# EasyEDA Pro project controller.eprj

# Schematic 主控

## Sheets
1 mcu: Board Name: 控制器; Create Date: 2025-05-31; Page Name: mcu; Project Name: controller; Schematic Name: 主控; Update Date: 2025-06-05; Company: 嘉立创EDA; Page Size: A4; Version: V1.0
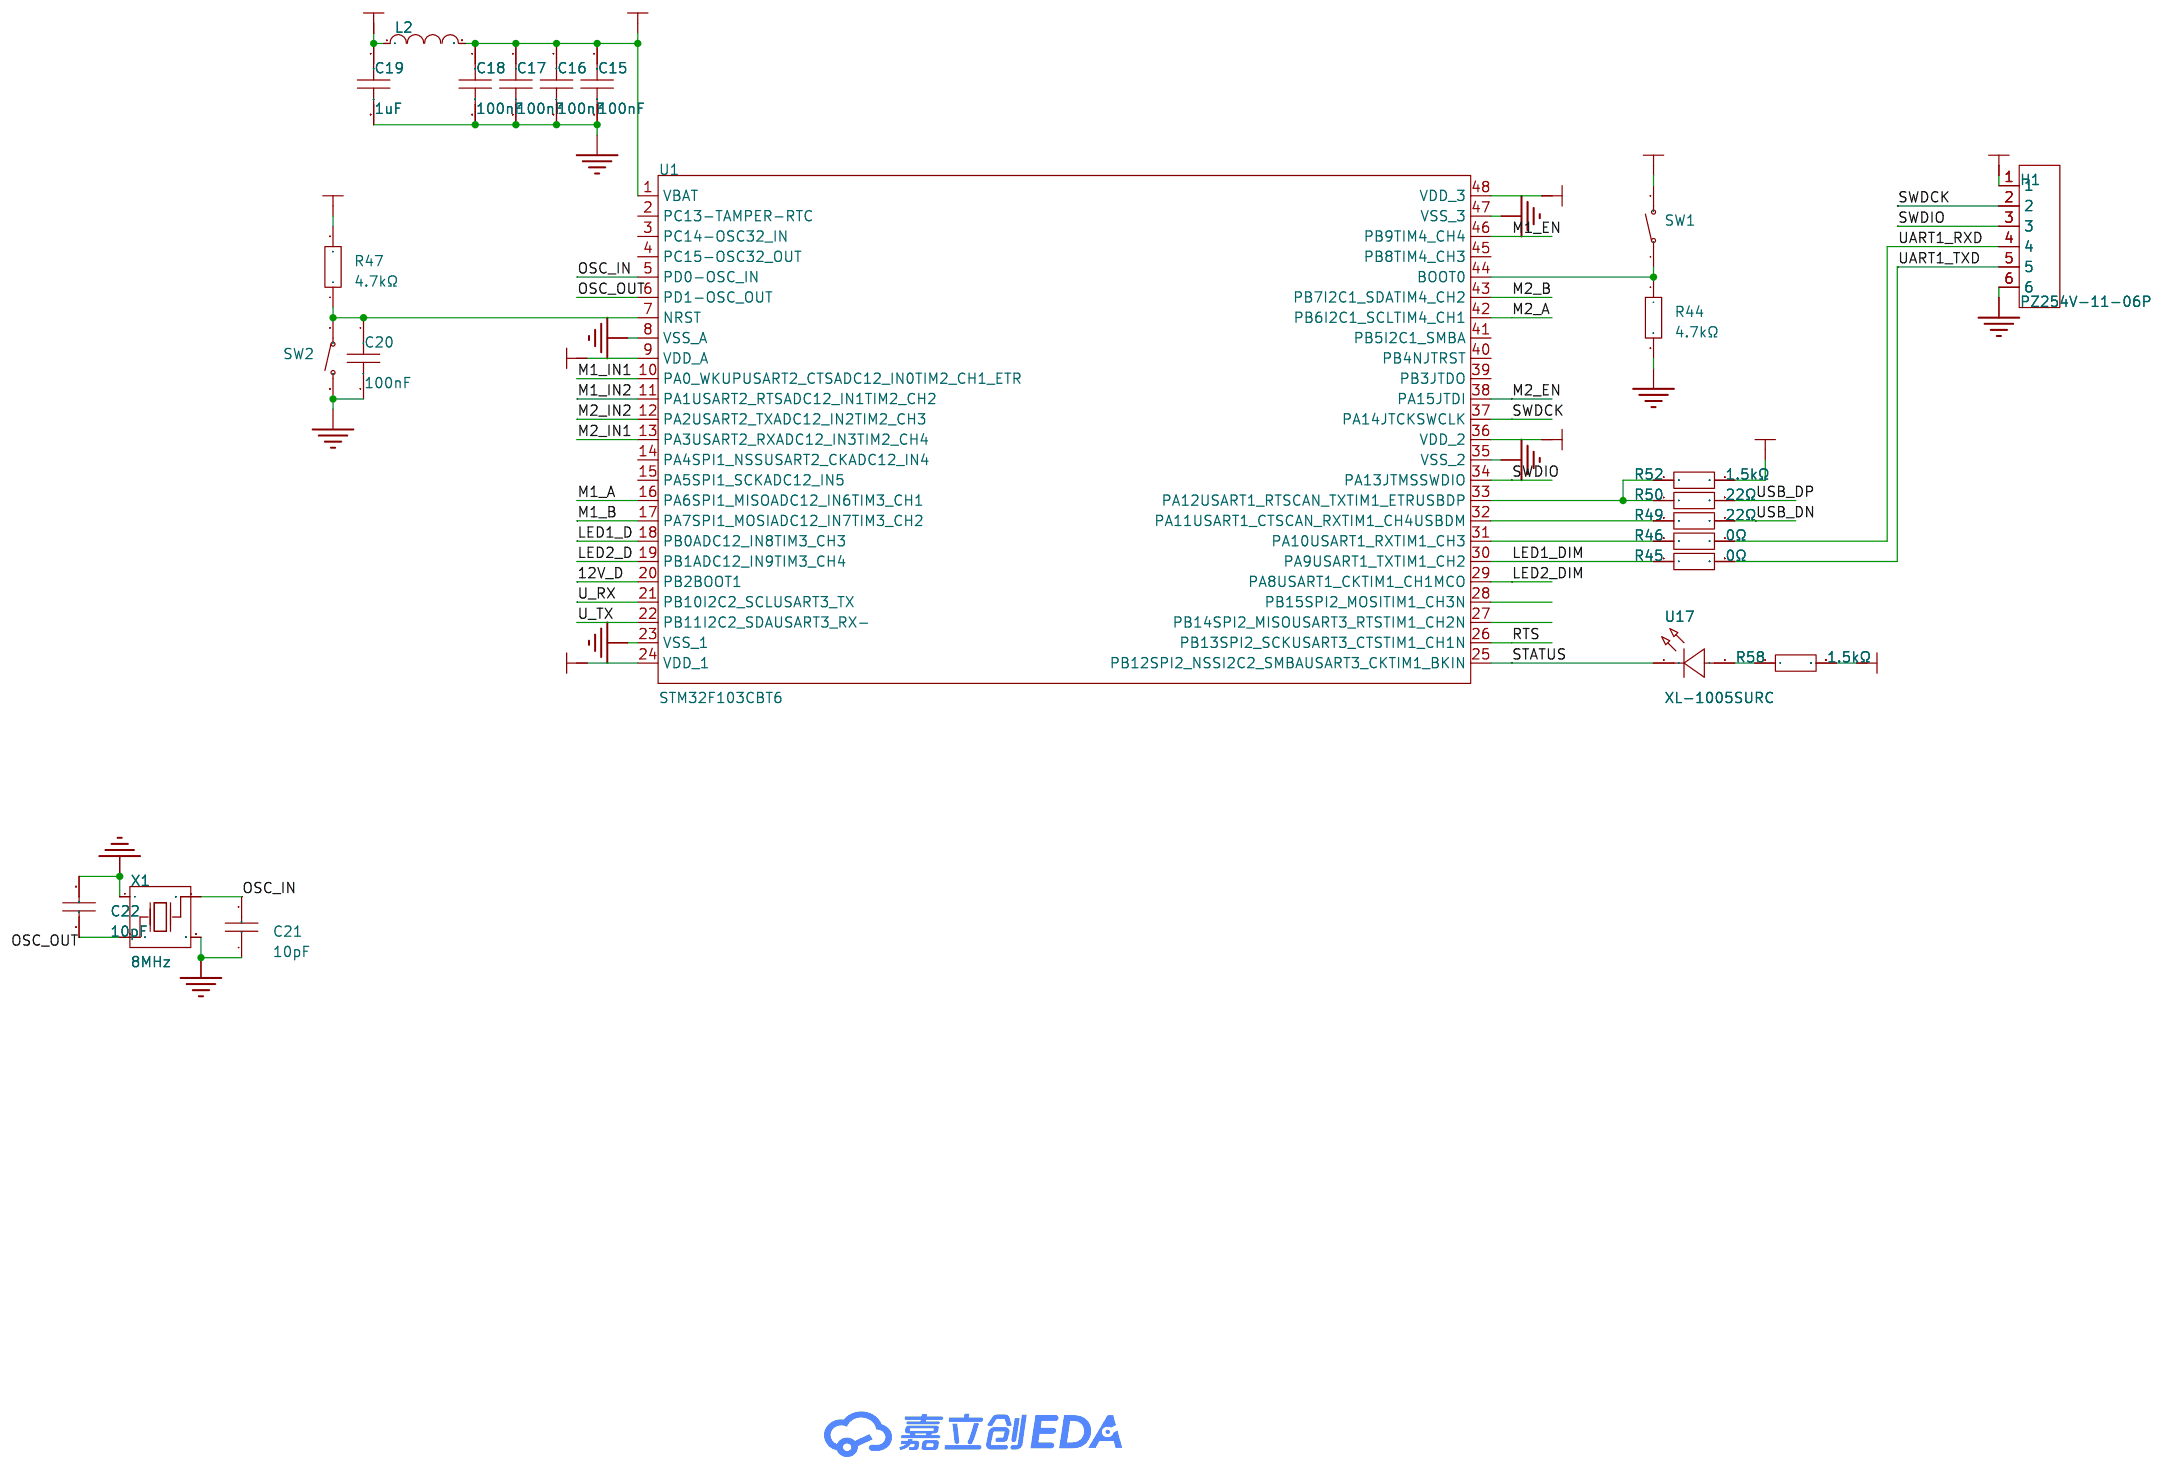
[diagram p0: mcu]
2 power: Page Name: power
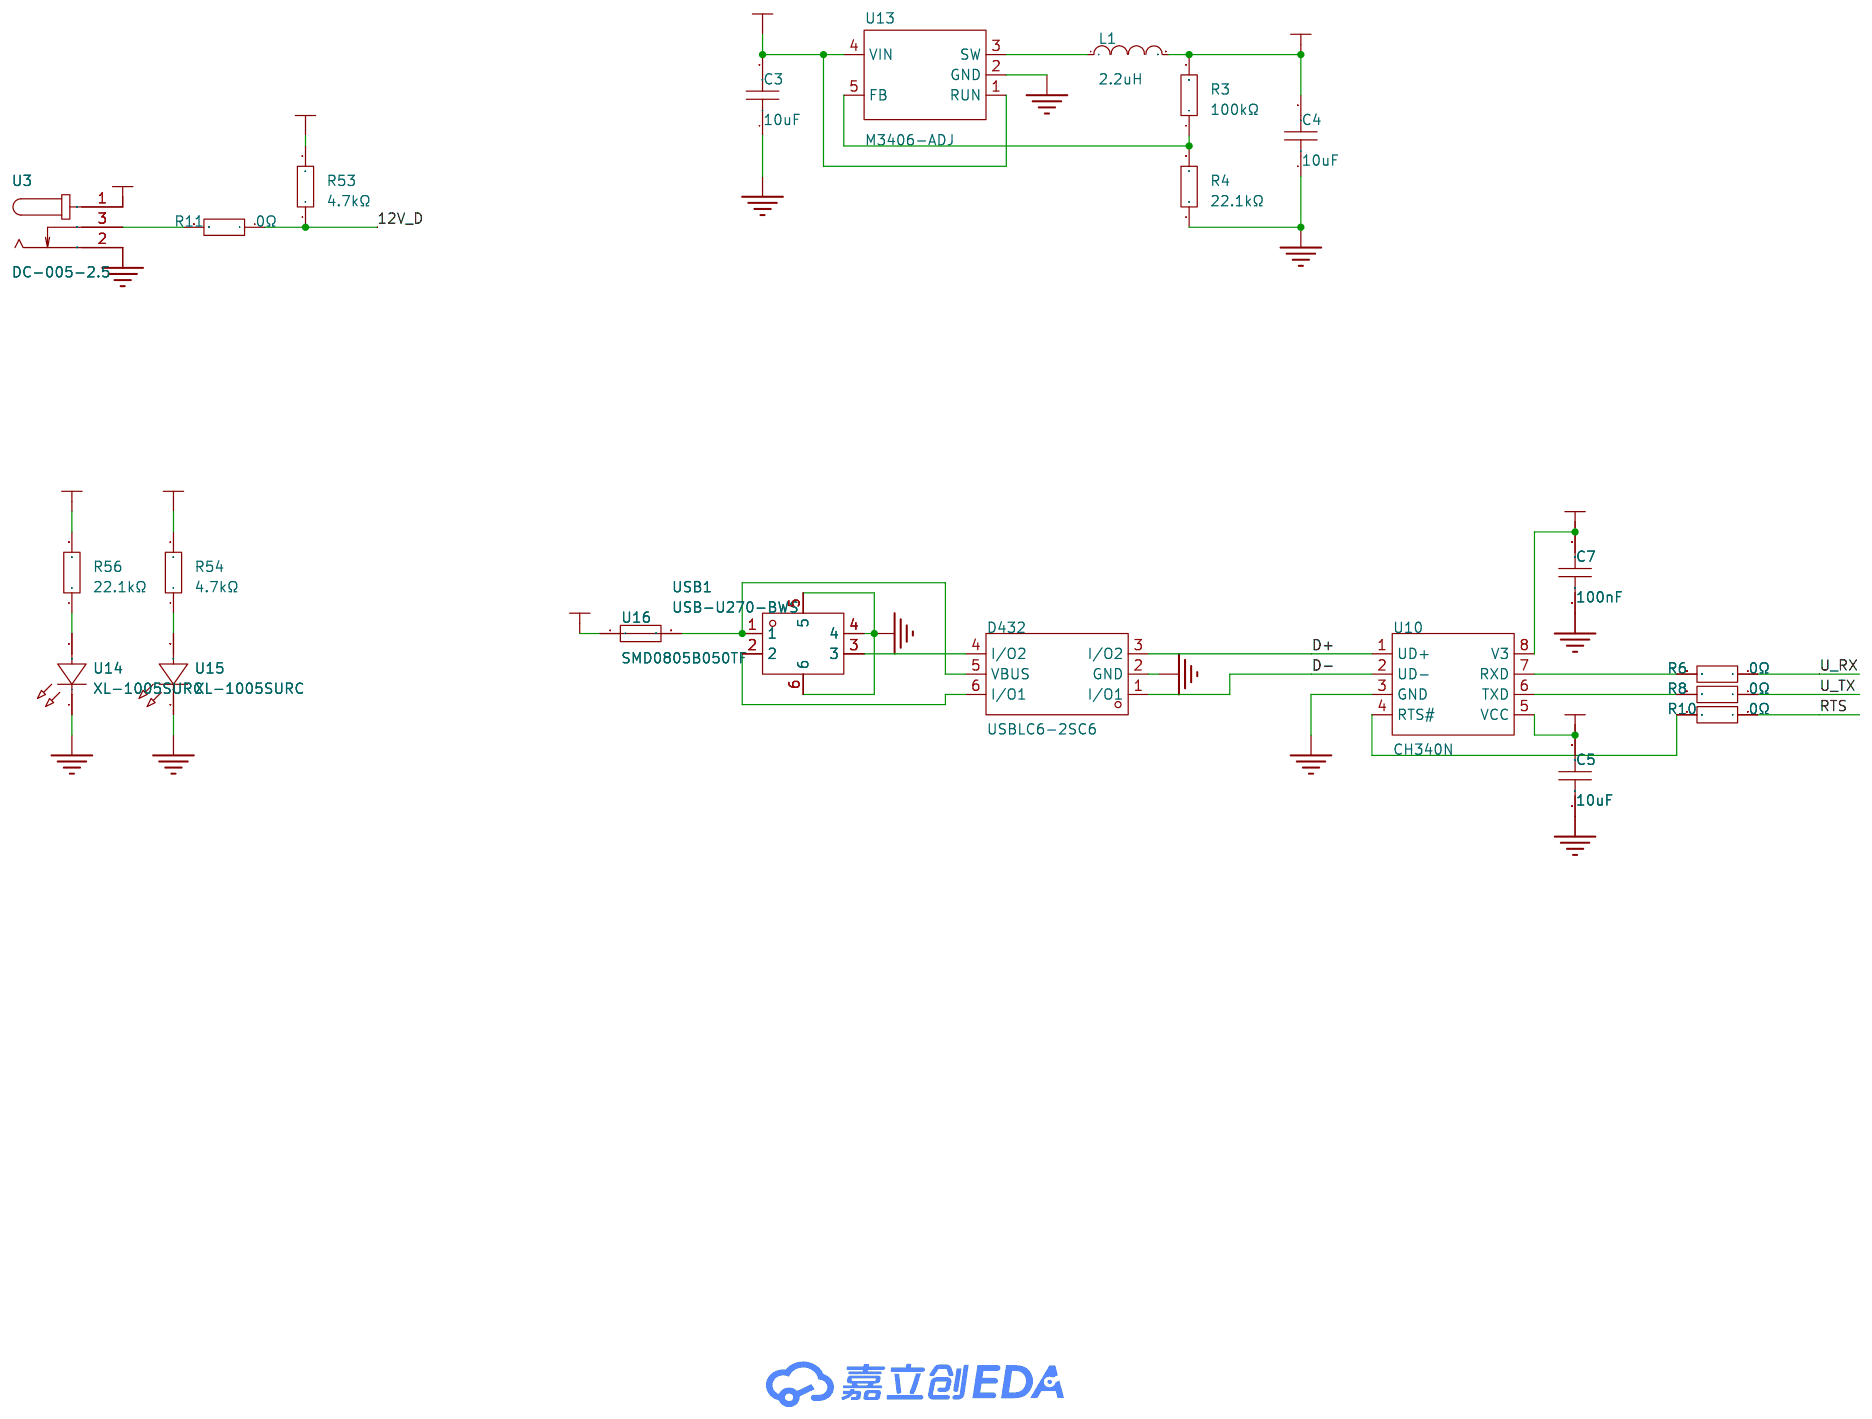
[diagram p1: power]
3 led: Page Name: led
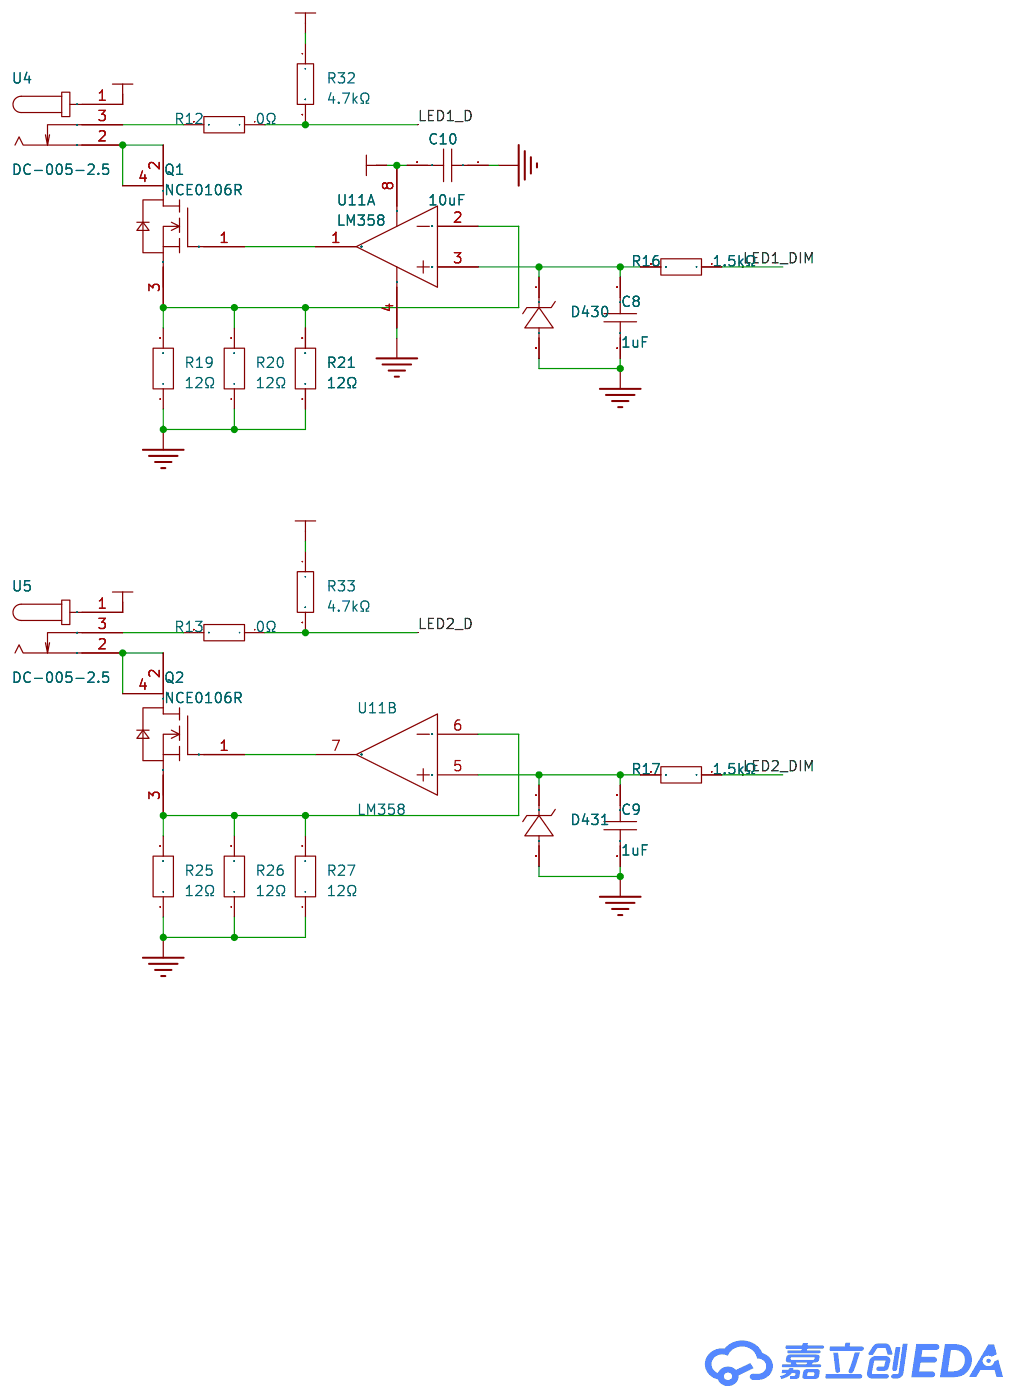
[diagram p2: led]
4 motor: Page Name: motor; Update Date: 2025-06-04
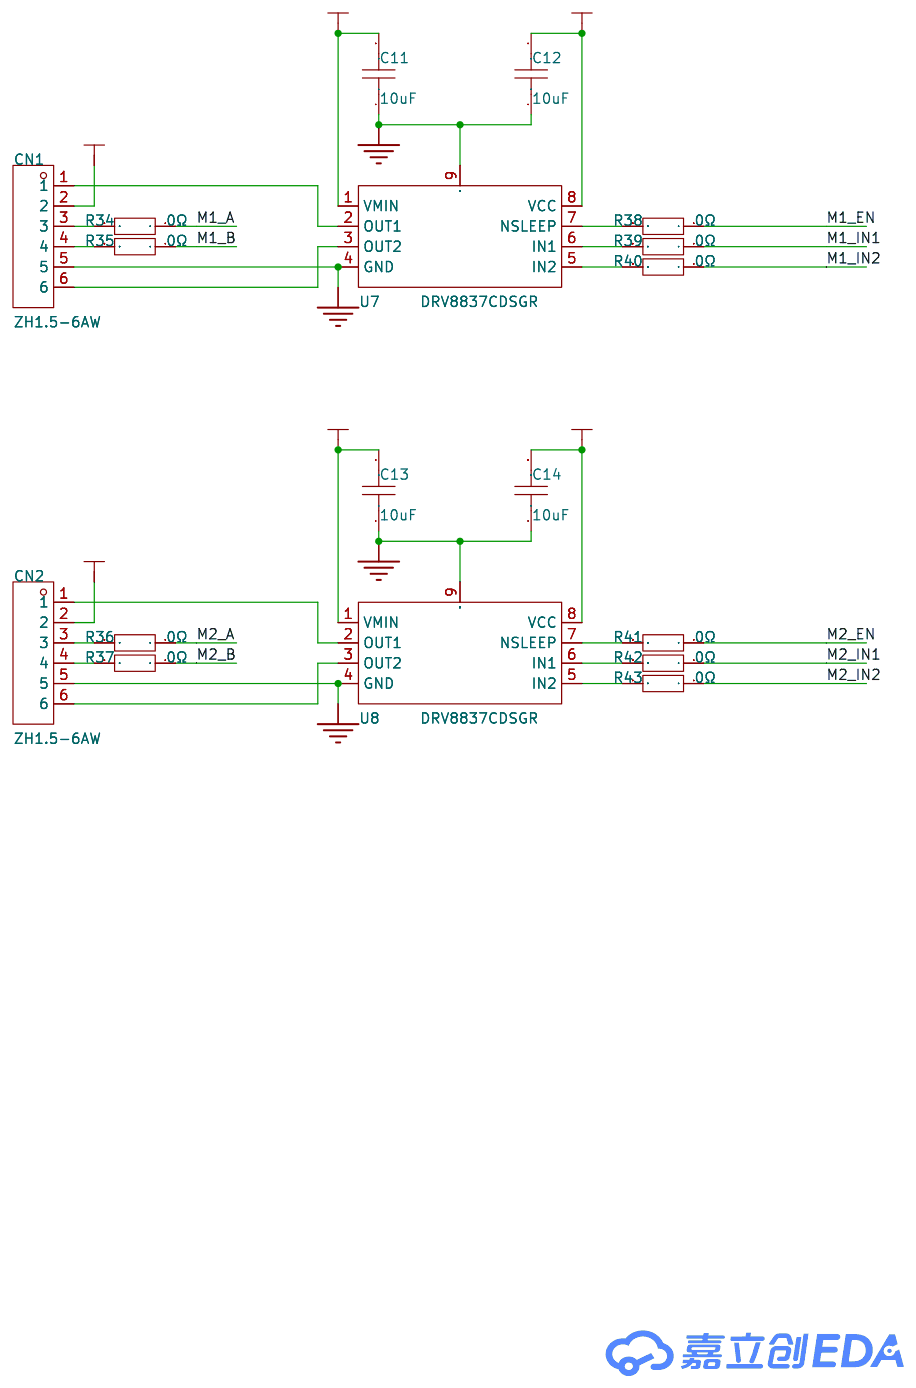
[diagram p3: motor]
5 typec: Create Date: 2025-06-05; Page Name: typec
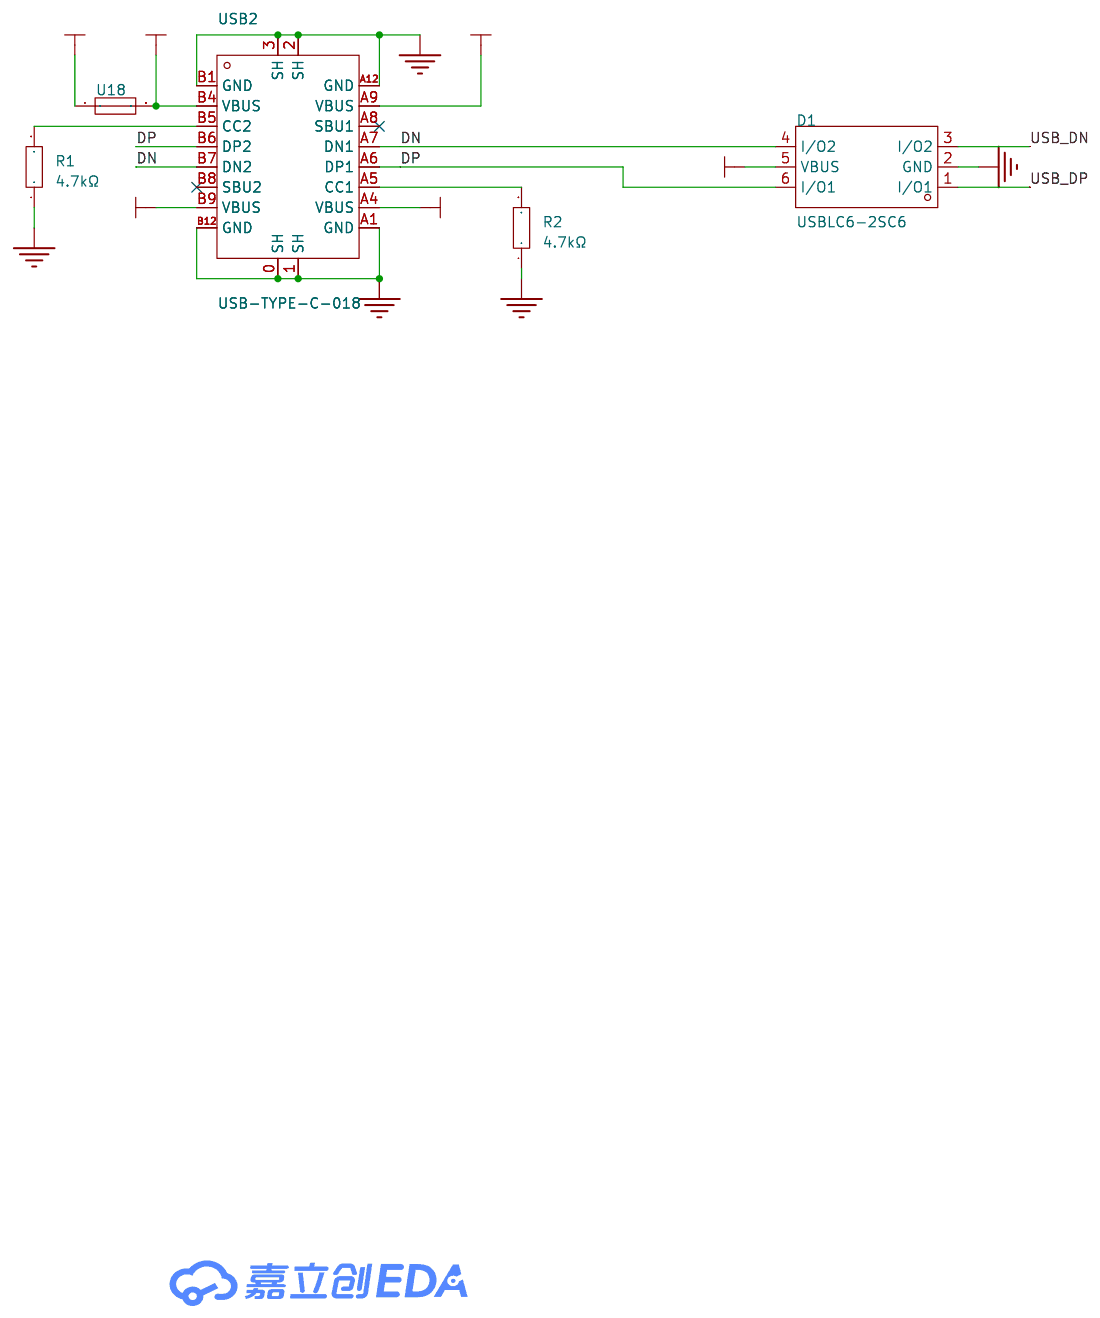
[diagram p4: typec]

## Parts
sheet led
C8  1uF  [C0402]
C9  1uF  [C0402]
C10  10uF  [C0603]
D430  ZMM3V3  [LL-34_L3.5-W1.5-RD]
D431  ZMM3V3  [LL-34_L3.5-W1.5-RD]
Q1  NCE0106R  [SOT-223_L6.5-W3.5-P2.30-LS7.0-BR]
Q2  NCE0106R  [SOT-223_L6.5-W3.5-P2.30-LS7.0-BR]
R12  0Ω  [R0402]
R13  0Ω  [R0402]
R16  1.5kΩ  [R0402]
R17  1.5kΩ  [R0402]
R19  12Ω  [R2512]
R20  12Ω  [R2512]
R21  12Ω  [R2512]
R25  12Ω  [R2512]
R26  12Ω  [R2512]
R27  12Ω  [R2512]
R32  4.7kΩ  [R0402]
R33  4.7kΩ  [R0402]
U4  DC-005-2.5  [DC-IN-TH_DC-005-2.5_C9900097950]
U5  DC-005-2.5  [DC-IN-TH_DC-005-2.5_C9900097950]
U11  LM358  [SOIC-8_L4.9-W3.9-P1.27-LS6.0-BL]  (sections 1,2)
sheet mcu
C15  100nF  [C0402]
C16  100nF  [C0402]
C17  100nF  [C0402]
C18  100nF  [C0402]
C19  1uF  [C0402]
C20  100nF  [C0402]
C21  10pF  [C0402]
C22  10pF  [C0402]
H1  PZ254V-11-06P  [HDR-TH_6P-P2.54-V-M]
L2  GZ1005D102CTF  [L0402]
R44  4.7kΩ  [R0402]
R45  0Ω  [R0402]
R46  0Ω  [R0402]
R47  4.7kΩ  [R0402]
R49  22Ω  [R0402]
R50  22Ω  [R0402]
R52  1.5kΩ  [R0402]
R58  1.5kΩ  [R0402]
SW1  TS342A2P 160gf 021  [KEY-SMD_L3.9-W3.0-LS5.0]
SW2  TS342A2P 160gf 021  [KEY-SMD_L3.9-W3.0-LS5.0]
U1  STM32F103CBT6  [LQFP-48_L7.0-W7.0-P0.50-LS9.0-BL]
U17  XL-1005SURC  [LED0402-RD]
X1  8MHz  [CRYSTAL-SMD_4P-L3.2-W2.5-BL]
sheet motor
C11  10uF  [C0603]
C12  10uF  [C0603]
C13  10uF  [C0603]
C14  10uF  [C0603]
CN1  ZH1.5-6AW  [CONN-TH_ZH1.5-6AW]
CN2  ZH1.5-6AW  [CONN-TH_ZH1.5-6AW]
R34  0Ω  [R0402]
R35  0Ω  [R0402]
R36  0Ω  [R0402]
R37  0Ω  [R0402]
R38  0Ω  [R0402]
R39  0Ω  [R0402]
R40  0Ω  [R0402]
R41  0Ω  [R0402]
R42  0Ω  [R0402]
R43  0Ω  [R0402]
U7  DRV8837CDSGR  [WSON-8_L2.0-W2.0-P0.50-TL-EP]
U8  DRV8837CDSGR  [WSON-8_L2.0-W2.0-P0.50-TL-EP]
sheet power
C3  10uF  [C0603]
C4  10uF  [C0603]
C5  10uF  [C0603]
C7  100nF  [C0402]
D432  USBLC6-2SC6  [SOT-23-6_L2.9-W1.6-P0.95-LS2.8-BL]
L1  2.2uH  [IND-SMD_L2.0-W1.6_WPN2016X]
R3  100kΩ  [R0402]
R4  22.1kΩ  [R0402]
R6  0Ω  [R0402]
R8  0Ω  [R0402]
R10  0Ω  [R0402]
R11  0Ω  [R0402]
R53  4.7kΩ  [R0402]
R54  4.7kΩ  [R0402]
R56  22.1kΩ  [R0402]
U3  DC-005-2.5  [DC-IN-TH_DC-005-2.5_C9900097950]
U10  CH340N  [SOP-8_L4.9-W3.9-P1.27-LS6.0-BL]
U13  M3406-ADJ  [SOT-23-5_L3.0-W1.7-P0.95-LS2.8-BR]
U14  XL-1005SURC  [LED0402-RD]
U15  XL-1005SURC  [LED0402-RD]
U16  SMD0805B050TF  [F0805]
USB1  USB-U270-BWS  [USB-TH_U270-BWS]
sheet typec
D1  USBLC6-2SC6  [SOT-23-6_L2.9-W1.6-P0.95-LS2.8-BL]
R1  4.7kΩ  [R0402]
R2  4.7kΩ  [R0402]
U18  SMD0805B050TF  [F0805]
USB2  USB-TYPE-C-018  [USB-C_SMD-TYPE-C-31-M-12]

## Library data of the parts
C8 C9 C19 = TCC0402X5R105K100AT: LCSC Part Name: 1uF ±10% 10V; Supplier Part: C380293; Manufacturer: CCTC(三环); Supplier Footprint: 0402; JLCPCB Part Class: Extended Part; Datasheet: https://atta.szlcsc.com/upload/public/pdf/source/20191203/C466239_F62A586702D44EEA1C39B32FC8662B21.pdf; Supplier: LCSC; Tolerance: ±10%; Voltage Rating: 10V; Temperature Coefficient: X5R
C3-C5 C10-C14 = TCC0603X5R106K100CT: 容值:10uF;精度:±10%;额定电压:10V;材质(温度系数):X5R;; LCSC Part Name: 10uF ±10% 10V; Supplier Part: C380314; Manufacturer: CCTC(三环); Supplier Footprint: 0603; JLCPCB Part Class: 扩展库; Datasheet: https://atta.szlcsc.com/upload/public/pdf/source/20191203/C466239_F62A586702D44EEA1C39B32FC8662B21.pdf; Supplier: LCSC; Tolerance: ±10%; Voltage Rated: 10V; Temperature Coefficient: X5R
D430 D431 = ZMM3V3_C5345987: LCSC Part Name: VR:3.3V VF:1V PD:0.5W; Supplier Part: C5345987; Manufacturer: HXY MOSFET(华轩阳电子); Supplier Footprint: LL-34; JLCPCB Part Class: Extended Part; Datasheet: https://atta.szlcsc.com/upload/public/pdf/source/20240618/6F23874EE88F10DEC9B7C51EC7F37B55.pdf; Supplier: LCSC; Diode Configuration: 独立式; Zener Voltage (Nom): 3.3V; Reverse Leakage Current (Ir): 2uA@1V; Zener Voltage (Range): 3.1V~3.5V; Power Dissipation: 500mW; Zener Impedance (Zzt): 85Ω
Q1 Q2 = NCE0106R: LCSC Part Name: 1个N沟道 耐压:100V 电流:6A; Supplier Part: C189607; Manufacturer: NCE(无锡新洁能); Supplier Footprint: SOT-223; JLCPCB Part Class: 扩展库; Datasheet: https://atta.szlcsc.com/upload/public/pdf/source/20180403/C189607_A68809A13E331E287348A0DCA5411F48.pdf; Supplier: LCSC; Type: 1个N沟道; Drain to Source Voltage: 100V; Current - Continuous Drain(Id): 6A; RDS(on): 140mΩ@10V,5A; Pd - Power Dissipation: 3W; Gate Threshold Voltage (Vgs(th)@Id): 2.5V; Gate Charge(Qg): 15.5nC@50V; Input Capacitance(Ciss@Vds): 690pF@25V; Reverse Transfer Capacitance (Crss@Vds): 90pF; Operating Temperature: -55℃~+150℃
R6 R8 R10-R13 R34-R43 R45 R46 = 0402WGF0000TCE: LCSC Part Name: 0Ω ±1% 62.5mW 厚膜电阻; Supplier Part: C17168; Manufacturer: UNI-ROYAL(厚声); Supplier Footprint: 0402; JLCPCB Part Class: Basic Part; Datasheet: https://atta.szlcsc.com/upload/public/pdf/source/20200306/C422600_1E6D84923E4A46A82E41ADD87F860B5C.pdf; Supplier: LCSC; Type: 厚膜电阻; Tolerance: ±1%; Power(Watts): 62.5mW; Overload Voltage (Max): 50V; Temperature Coefficient: ±800ppm/℃; Operating Temperature Range: -55℃~+155℃
R16 R17 R52 R58 = 0402WGF1501TCE: LCSC Part Name: 1.5kΩ ±1% 62.5mW 厚膜电阻; Supplier Part: C25867; Manufacturer: UNI-ROYAL(厚声); Supplier Footprint: 0402; JLCPCB Part Class: Basic Part; Datasheet: https://atta.szlcsc.com/upload/public/pdf/source/20200306/C422600_1E6D84923E4A46A82E41ADD87F860B5C.pdf; Supplier: LCSC; Type: 厚膜电阻; Tolerance: ±1%; Power(Watts): 62.5mW; Overload Voltage (Max): 50V; Temperature Coefficient: ±100ppm/℃; Operating Temperature Range: -55℃~+155℃
R19-R21 R25-R27 = RC2512FK-7W12RL: LCSC Part Name: 厚膜电阻 12Ω ±1% 2W; Supplier Part: C5355394; Manufacturer: YAGEO(国巨); Supplier Footprint: 2512; JLCPCB Part Class: 扩展库; Datasheet: https://atta.szlcsc.com/upload/public/pdf/source/20230206/8B8ABBBDBFC6C7E819F5B24657171D91.pdf; Supplier: LCSC; Type: 厚膜电阻; Tolerance: ±1%; Power(Watts): 2W; Temperature Coefficient: ±200ppm/℃; Operating Temperature Range: -55℃~+155℃
R32 R33 R44 R47 R53 R54 = RTT02472JTH: 电阻类型:厚膜电阻;阻值:4.7kΩ;精度:±5%;功率:62.5mW;最大工作电压:50V;温度系数:±100ppm/℃;; LCSC Part Name: 厚膜电阻 4.7kΩ ±5% 62.5mW; Supplier Part: C103059; Manufacturer: RALEC(旺诠); Supplier Footprint: 0402; JLCPCB Part Class: Extended Part; Datasheet: https://atta.szlcsc.com/upload/public/pdf/source/20191219/C158410_884373A5B7E1BC76BF57BC45A946C093.pdf; Supplier: LCSC; Type: 厚膜电阻; Tolerance: ±5%; Power(Watts): 62.5mW; Overload Voltage (Max): 50V; Temperature Coefficient: ±100ppm/℃; Operating Temperature Range: -55℃~+155℃
U3-U5 = DC-005-2.5: LCSC Part Name: DC电源插座 内径:2.5mm 外径:6.3mm; Supplier Part: C22459639; Manufacturer: HanElectricity(瀚源); Supplier Footprint: 插件; JLCPCB Part Class: Extended Part; Datasheet: https://atta.szlcsc.com/upload/public/pdf/source/20240612/BBF77DB7BFBAEC22385448335158FF70.pdf; Supplier: LCSC; Connector Type: DC电源插座; Mounting Type: 弯插; Inside Contact Diameter: 2.5mm; Outside Contact Diameter: 6.3mm
U11 = LM358_C18164495: Supplier Part: C18164495; Manufacturer: GR(国睿); Supplier Footprint: SOP-8; JLCPCB Part Class: 扩展库; Datasheet: https://atta.szlcsc.com/upload/public/pdf/source/20230915/61FCD93696E3C74FE503DA1B272BFF1F.pdf; Supplier: LCSC; Number of Channels: 双路; Maximum Power Supply Range (Vdd-Vss): 36V; Gain Bandwidth Product: 1.2MHz; Vos - Input Offset Voltage: 5mV; Ib - Input Bias Current: 50nA; Common Mode Rejection Ratio(CMRR): 80dB; Operating Temperature: 0℃~+70℃
C7 C15-C18 C20 = TCC0402X5R104M250AT: 容值:100nF;精度:±20%;额定电压:25V;温度系数:X5R;; LCSC Part Name: 100nF ±20% 25V; Supplier Part: C359190; Manufacturer: CCTC(三环); Supplier Footprint: 0402; JLCPCB Part Class: Extended Part; Datasheet: https://atta.szlcsc.com/upload/public/pdf/source/20191203/C466239_F62A586702D44EEA1C39B32FC8662B21.pdf; Supplier: LCSC; Tolerance: ±20%; Voltage Rated: 25V; Temperature Coefficient: X5R; Voltage Rating: 25V
C21 C22 = CC0402JRNPO9BN100: LCSC Part Name: 10pF ±5% 50V; Supplier Part: C106199; Manufacturer: YAGEO(国巨); Supplier Footprint: 0402; JLCPCB Part Class: 扩展库; Datasheet: https://atta.szlcsc.com/upload/public/pdf/source/20181008/C309499_21CC21451B82C39E3D92150FD6B30293.pdf; Supplier: LCSC; Tolerance: ±5%; Voltage Rated: 50V; Temperature Coefficient: NP0
H1 = PZ254V-11-06P: LCSC Part Name: 1x6P 间距:2.54mm 方针 直插; Supplier Part: C492405; Manufacturer: XFCN(兴飞); Supplier Footprint: 插件,P=2.54mm; JLCPCB Part Class: Extended Part; Datasheet: https://atta.szlcsc.com/upload/public/pdf/source/20200309/C492405_597F1930F5B55CC3C7FD95458F1C3977.pdf; Supplier: LCSC; Pin Structure: 1x6P; Pitch: 2.54mm; Circluar Pins/Square Pins: 方针; Mounting Type: 直插; Number of Rows: 单排; Number of Pins: 6P; Length of Mating Pin: 6mm; Insulation Height: 2.5mm; Length of End Connection Pin: 3mm; Contact Material: 黄铜; Operating Temperature: -40℃~+105℃; Color: 黑色
L2 = GZ1005D102CTF: LCSC Part Name: 单路 0402磁珠 阻抗1kΩ@100MHz; Supplier Part: C96679; Manufacturer: Sunlord(顺络); Supplier Footprint: 0402; JLCPCB Part Class: 扩展库; Datasheet: https://atta.szlcsc.com/upload/public/pdf/source/20241120/9674879518A771649AC878246C37E11D.pdf; Supplier: LCSC; Impedance @ Frequency: 1kΩ@100MHz; Tolerance: ±25%; DC Resistance: 700mΩ; Current Rating: 150mA; Circuits: 1
R49 R50 = 0402WGF220JTCE: LCSC Part Name: 22Ω ±1% 62.5mW 厚膜电阻; Supplier Part: C25092; Manufacturer: UNI-ROYAL(厚声); Supplier Footprint: 0402; JLCPCB Part Class: Basic Part; Datasheet: https://atta.szlcsc.com/upload/public/pdf/source/20200306/C422600_1E6D84923E4A46A82E41ADD87F860B5C.pdf; Supplier: LCSC; Type: 厚膜电阻; Tolerance: ±1%; Power(Watts): 62.5mW; Overload Voltage (Max): 50V; Temperature Coefficient: ±100ppm/℃; Operating Temperature Range: -55℃~+155℃
SW1 SW2 = TS342A2P 160gf 021: LCSC Part Name: 正按小龟 3*4*2mm 两脚不带柱 160gf 黑色塑胶按钮; Supplier Part: C5373431; Manufacturer: SHOU HAN(首韩); Supplier Footprint: SMD; JLCPCB Part Class: 扩展库; Datasheet: https://atta.szlcsc.com/upload/public/pdf/source/20240424/23B385020986CAF015868F86EB8FE759.pdf; Supplier: LCSC; Circuit: 单刀单掷; Actuator Style: 圆形按钮; Operating Force: 1.6N; Mounting Style: 立贴; Strike Gundam: 不带; Contact Current: 50mA; Voltage Rating (DC): 12V; Insulation Resistance: 100MΩ; Actuator/Cap Color: 黑色; With Lamp: 无; Pin Style: SMD接片; Mechanical Life: 3万次; Operating Temperature: -25℃~+70℃
U1 = STM32F103CBT6: LCSC Part Name: 主流增强型ARM Cortex-M3 MCU，具有128 KB Flash、72 MHz CPU、电机控制、USB和CAN; Supplier Part: C8304; Manufacturer: ST(意法半导体); Supplier Footprint: LQFP-48(7x7); JLCPCB Part Class: 扩展库; Datasheet: https://atta.szlcsc.com/upload/public/pdf/source/20150811/1457707344439.pdf; Supplier: LCSC; CPU Core: ARM-M3; CPU Maximum Speed: 72MHz; Program Storage Size: 128KB; Program Memory Type: FLASH; Number of I/O: 37; ADC (Bit): 12bit; Voltage - Supply: 2V~3.6V
U14 U15 U17 = XL-1005SURC_C25503345: Supplier Part: C25503345; Manufacturer: XINGLIGHT(成兴光); Supplier Footprint: 0402; JLCPCB Part Class: 扩展库; Datasheet: https://atta.szlcsc.com/upload/public/pdf/source/20240218/3E35D8C8C655513CBB230AD632A31215.pdf; Supplier: LCSC
X1 = TAXM8M4RDBCCT2T: LCSC Part Name: 8MHz ±10ppm 10pF; Supplier Part: C400090; Manufacturer: YJX(雅晶鑫); Supplier Footprint: SMD3225-4P; JLCPCB Part Class: 扩展库; Datasheet: https://atta.szlcsc.com/upload/public/pdf/source/20190626/C400090_CF95B89E745AFE4EF2E392EF8AC009D6.pdf; Supplier: LCSC; Type: 贴片晶振; Normal temperature Frequency Tolerance: ±10ppm; Load Capacitance: 10pF; Frequency Stability: ±15ppm; Equivalent Series Resistance(ESR): 250Ω; Operating Temperature: -40℃~+85℃
CN1 CN2 = ZH1.5-6AW: LCSC Part Name: 1x6P 间距:1.5mm 弯插 系列:ZH; Supplier Part: C722927; Manufacturer: CAX(创都); Supplier Footprint: 弯插,P=1.5mm; JLCPCB Part Class: 扩展库; Datasheet: https://atta.szlcsc.com/upload/public/pdf/source/20200902/C722911_42E2723B5949F1A53CC1FDAC81FF72CA.pdf; Supplier: LCSC; Pins Structure: 1x6P; Pitch: 1.5mm; Mounting Style: 弯插; Reference Series: ZH; Number of Pins: 6P; Number of Rows: 1; Number of PINs Per Row: 6; Current Rating (Max): 1A; Operating Temperature Range: -25℃~+85℃
U7 U8 = DRV8837CDSGR: LCSC Part Name: 1A 有刷直流电机驱动芯片 7V; Supplier Part: C191000; Manufacturer: TI(德州仪器); Supplier Footprint: WSON-8-EP(2x2); JLCPCB Part Class: 扩展库; Datasheet: https://www.ti.com/cn/lit/gpn/drv8837c; Supplier: LCSC
D1 D432 = USBLC6-2SC6: 最大钳位电压:15V;击穿电压:6V;; Supplier Part: C2687116; Manufacturer: UMW(友台半导体); Supplier Footprint: SOT-23-6; JLCPCB Part Class: 扩展库; Datasheet: https://atta.szlcsc.com/upload/public/pdf/source/20231109/512642D850D9873E7C519F71E85B9A10.pdf; Supplier: LCSC; Maximum Clamping Voltage: 15V; Breakdown Voltage: 6V; Number of Lines: 双路; Type: ESD
L1 = WPN201610H2R2MT: 电感值:2.2uH;精度:±20%;额定电流:1.45A;饱和电流(Isat):2.15A;类型:-;; LCSC Part Name: 2.2uH ±20% 2.15A; Supplier Part: C97005; Manufacturer: Sunlord(顺络); Supplier Footprint: 0806; JLCPCB Part Class: 扩展库; Datasheet: https://atta.szlcsc.com/upload/public/pdf/source/20231024/AA72387348CB63159A6CBE41DDE5ECDA.pdf; Supplier: LCSC; Tolerance: ±20%; Rated Current: 1.45A; Current - Saturation(Isat): 2.15A; DC Resistance(DCR): 170mΩ
R3 = RTT021003FTH: 电阻类型:厚膜电阻;阻值:100kΩ;精度:±1%;功率:62.5mW;最大工作电压:50V;温度系数:±100ppm/℃;; LCSC Part Name: 厚膜电阻 100kΩ ±1% 62.5mW; Supplier Part: C102750; Manufacturer: RALEC(旺诠); Supplier Footprint: 0402; JLCPCB Part Class: 扩展库; Datasheet: https://atta.szlcsc.com/upload/public/pdf/source/20191219/C158410_884373A5B7E1BC76BF57BC45A946C093.pdf; Supplier: LCSC; Type: 厚膜电阻; Tolerance: ±1%; Power(Watts): 62.5mW; Overload Voltage (Max): 50V; Temperature Coefficient: ±100ppm/℃; Operating Temperature Range: -55℃~+155℃
R4 R56 = 0402WGF2212TCE: 电阻类型:厚膜电阻;阻值:22.1kΩ;精度:±1%;功率:62.5mW;最大工作电压:50V;温度系数:±100ppm/℃;; LCSC Part Name: 22.1kΩ ±1% 62.5mW 厚膜电阻; Supplier Part: C43473; Manufacturer: UNI-ROYAL(厚声); Supplier Footprint: 0402; JLCPCB Part Class: 扩展库; Datasheet: https://atta.szlcsc.com/upload/public/pdf/source/20200306/C422600_1E6D84923E4A46A82E41ADD87F860B5C.pdf; Supplier: LCSC; Type: 厚膜电阻; Tolerance: ±1%; Power(Watts): 62.5mW; Overload Voltage (Max): 50V; Temperature Coefficient: ±100ppm/℃; Operating Temperature Range: -55℃~+155℃
U10 = CH340N: LCSC Part Name: USB2.0芯片CH340; Supplier Part: C2977777; Manufacturer: WCH(南京沁恒); Supplier Footprint: SOP-8; JLCPCB Part Class: 扩展库; Datasheet: https://atta.szlcsc.com/upload/public/pdf/source/20240313/115CDE92081B1D6CB446704AD5D0F5F2.pdf; Supplier: LCSC; Applications Function: USB转串口; Protocol: USB 2.0; Number of Channels: 1; Voltage - Supply: 3.3V；5V; Data Rate: 2Mbps; Operating Temperature: -20℃~+70℃
U13 = M3406-ADJ: LCSC Part Name: 1.5MHz 800mA 同步降压转换器; Supplier Part: C83224; Manufacturer: 西安航天民芯; Supplier Footprint: SOT-23-5; JLCPCB Part Class: 扩展库; Datasheet: https://atta.szlcsc.com/upload/public/pdf/source/20180301/C181743_15198944852831384030.pdf; Supplier: LCSC; Function: 降压型; Output Type: 可调; Voltage - Supply: 2V~6V; Output Current: 800mA; Frequency - Switching: 1.5MHz; Operating Temperature: -40℃~+85℃; Synchronous Rectifier: 是; Number of Outputs: 1; Topology: 降压式; Quiescent Current: 20uA; Switch tube (built-in/external): 内置
U16 U18 = SMD0805B050TF: LCSC Part Name: 6V 500mA 0805自恢复; Supplier Part: C269104; Manufacturer: Brightking(君耀电子); Supplier Footprint: 0805; JLCPCB Part Class: 扩展库; Datasheet: https://atta.szlcsc.com/upload/public/pdf/source/20180913/C269107_1BF28CF6F4C5BFD5B8CD673BC8D2B923.pdf; Supplier: LCSC; Voltage - Max: 6V; Current - Max: 100A; Hold Current: 500mA; Trip Current: 1A; Resistance - Initial (Ri) (Min): 150mΩ; Time to Trip(Max): 100ms; Operating Temperature: -40℃~+85℃；-40℃~+85℃；-40℃~+85℃
USB1 = USB-U270-BWS: LCSC Part Name: Type-B 母 弯插; Supplier Part: C2962393; Manufacturer: HANBO(汉博); Supplier Footprint: 插件; JLCPCB Part Class: 扩展库; Datasheet: https://atta.szlcsc.com/upload/public/pdf/source/20221111/2E1C184314407F971D0E35DE994ADB82.pdf; Supplier: LCSC; Connector Type: Type-B; Standard: USB 2.0; Gender: 母; Mounting Style: 弯插; Number of Contacts: 4P; Number of Ports: 1
R1 R2 = RTT02472JTH: 电阻类型:厚膜电阻;阻值:4.7kΩ;精度:±5%;功率:62.5mW;最大工作电压:50V;温度系数:±100ppm/℃;; LCSC Part Name: 厚膜电阻 4.7kΩ ±5% 62.5mW; Supplier Part: C103059; Manufacturer: RALEC(旺诠); Supplier Footprint: 0402; JLCPCB Part Class: 扩展库; Datasheet: https://atta.szlcsc.com/upload/public/pdf/source/20191219/C158410_884373A5B7E1BC76BF57BC45A946C093.pdf; Supplier: LCSC; Type: 厚膜电阻; Tolerance: ±5%; Power(Watts): 62.5mW; Overload Voltage (Max): 50V; Temperature Coefficient: ±100ppm/℃; Operating Temperature Range: -55℃~+155℃
USB2 = USB-TYPE-C-018: 连接器类型:Type-C;标准:-;公母:母;安装方式:卧贴;触点数量:16P;端口数量:1;额定电流 - 电源:3A;工作温度范围:-25℃~+85℃;; LCSC Part Name: Type-C 母 卧贴; Supplier Part: C2927038; Manufacturer: DEALON(德艺隆); Supplier Footprint: SMD; JLCPCB Part Class: 扩展库; Datasheet: https://atta.szlcsc.com/upload/public/pdf/source/20211217/CCD3D517E355E8E0CC52ABD8D5784AD8.pdf; Supplier: LCSC; Connector Type: Type-C; Gender: 母; Mounting Style: 卧贴; Number of Contacts: 16P; Number of Ports: 1; Current Rating - Power (Max): 3A; Operating Temperature Range: -25℃~+85℃

## Nets
3V3: C4.2 C7.2 C12.2 C14.2 C15.1 C16.1 C17.1 C18.1 CN1.2 CN2.2 H1.1 L1.2 L2.2 R3.2 R32.1 R33.1 R47.2 R52.2 R53.2 R58.2 SW1.2 U1.1(VBAT) U1.24(VDD_1) U1.36(VDD_2) U1.48(VDD_3) U7.8(VCC) U8.8(VCC) U10.8(V3)
3V3_A: C19.1 L2.1 U1.9(VDD_A)
12V: R56.2 U3.1 U4.1 U5.1
12V_D: R11.1 R53.1 U1.20(PB2BOOT1)
GND: C3.1 C4.1 C5.1 C7.1 C8.1 C9.1 C10.1 C11.1 C12.1 C13.1 C14.1 C15.2 C16.2 C17.2 C18.2 C19.2 C20.2 C21.1 C22.2 CN1.5 CN2.5 D1.2(GND) D430.2(A) D431.2(A) D432.2(GND) H1.6 R1.1 R2.1 R4.1 R19.1 R20.1 R21.1 R25.1 R26.1 R27.1 R44.2 SW2.2 U1.8(VSS_A) U1.23(VSS_1) U1.35(VSS_2) U1.47(VSS_3) U3.2 U7.4(GND) U7.9(PAD) U8.4(GND) U8.9(PAD) U10.3(GND) U11.4(VEE) U13.2(GND) U14.1(K) U15.1(K) USB1.4 USB1.5 USB1.6 USB2.0(SH) USB2.1(SH) USB2.2(SH) USB2.3(SH) USB2.A1(GND) USB2.A12(GND) USB2.B1(GND) USB2.B12(GND) X1.2 X1.4
VBUS: D1.5(VBUS) U18.2 USB2.A4(VBUS) USB2.A9(VBUS) USB2.B4(VBUS) USB2.B9(VBUS)
D+: D432.3(I/O2) U10.1(UD+)
D-: D432.1(I/O1) U10.2(UD-)
DN: D1.4(I/O2) USB2.A7(DN1) USB2.B7(DN2)
DP: D1.6(I/O1) USB2.A6(DP1) USB2.B6(DP2)
LED1_D: R12.1 R32.2 U1.18(PB0ADC12_IN8TIM3_CH3)
LED1_DIM: R16.1 R45.1 U1.30(PA9USART1_TXTIM1_CH2)
LED2_D: R13.1 R33.2 U1.19(PB1ADC12_IN9TIM3_CH4)
LED2_DIM: R17.1 U1.29(PA8USART1_CKTIM1_CH1MCO)
M1_A: R34.1 U1.16(PA6SPI1_MISOADC12_IN6TIM3_CH1)
M1_B: R35.1 U1.17(PA7SPI1_MOSIADC12_IN7TIM3_CH2)
M1_EN: R38.1 U1.46(PB9TIM4_CH4)
M1_IN1: R39.1 U1.10(PA0_WKUPUSART2_CTSADC12_IN0TIM2_CH1_ETR)
M1_IN2: R40.1 U1.11(PA1USART2_RTSADC12_IN1TIM2_CH2)
M2_A: R36.1 U1.42(PB6I2C1_SCLTIM4_CH1)
M2_B: R37.1 U1.43(PB7I2C1_SDATIM4_CH2)
M2_EN: R41.1 U1.38(PA15JTDI)
M2_IN1: R42.1 U1.13(PA3USART2_RXADC12_IN3TIM2_CH4)
M2_IN2: R43.1 U1.12(PA2USART2_TXADC12_IN2TIM2_CH3)
OSC_IN: C21.2 U1.5(PD0-OSC_IN) X1.3
OSC_OUT: C22.1 U1.6(PD1-OSC_OUT) X1.1
RTS: R10.1 U1.26(PB13SPI2_SCKUSART3_CTSTIM1_CH1N)
STATUS: U1.25(PB12SPI2_NSSI2C2_SMBAUSART3_CKTIM1_BKIN) U17.1(K)
SWDCK: H1.2 U1.37(PA14JTCKSWCLK)
SWDIO: H1.3 U1.34(PA13JTMSSWDIO)
U_RX: R6.1 U1.21(PB10I2C2_SCLUSART3_TX)
U_TX: R8.1 U1.22(PB11I2C2_SDAUSART3_RX-)
UART1_RXD: H1.4 R46.2
UART1_TXD: H1.5 R45.2
USB_DN: D1.3(I/O2) R49.2
USB_DP: D1.1(I/O1) R50.2
VUSB: C3.2 C5.2 C10.2 C11.2 C13.2 R54.2 U7.1(VMIN) U8.1(VMIN) U10.5(VCC) U11.8(VCC) U13.1(RUN) U13.4(VIN) U16.1 U18.1
$1N1587: R44.1 SW1.1 U1.44(BOOT0)
$1N1759: R46.1 U1.31(PA10USART1_RXTIM1_CH3)
$1N1998: C20.1 R47.1 SW2.1 U1.7(NRST)
$1N2957: R58.1 U17.2(A)
$1N4338: R50.1 R52.1 U1.33(PA12USART1_RTSCAN_TXTIM1_ETRUSBDP)
$1N4342: R49.1 U1.32(PA11USART1_CTSCAN_RXTIM1_CH4USBDM)
$2N1030: L1.1 U13.3(SW)
$2N1031: R3.1 R4.2 U13.5(FB)
$2N1800: R6.2 U10.7(RXD)
$2N1804: R8.2 U10.6(TXD)
$2N1809: R10.2 U10.4(RTS#)
$2N1973: R11.2 U3.3
$2N2732: R56.1 U14.2(A)
$2N2770: R54.1 U15.2(A)
$2N2922: D432.5(VBUS) U16.2 USB1.1
$2N4697: D432.4(I/O2) USB1.3
$2N4704: D432.6(I/O1) USB1.2
$3N875: R12.2 U4.3
$3N910: R13.2 U5.3
$3N942: Q1.2(D) Q1.4(D) U4.2
$3N971: Q2.2(D) Q2.4(D) U5.2
$3N1074: Q2.3(S) R25.2 R26.2 R27.2 U11.6(IN B-)
$3N1402: Q1.1(G) U11.1(OUT A)
$3N1420: Q2.1(G) U11.7(OUT B)
$3N1439: C8.2 D430.1(C) R16.2 U11.3(IN A+)
$3N1444: C9.2 D431.1(C) R17.2 U11.5(IN B+)
$3N3109: Q1.3(S) R19.2 R20.2 R21.2 U11.2(IN A-)
$4N1059: CN2.6 U8.3(OUT2)
$4N1106: CN2.3 R36.2
$4N1110: CN2.4 R37.2
$4N1129: CN2.1 U8.2(OUT1)
$4N1168: CN1.6 U7.3(OUT2)
$4N1172: CN1.1 U7.2(OUT1)
$4N1176: CN1.3 R34.2
$4N1179: CN1.4 R35.2
$4N1448: R39.2 U7.6(IN1)
$4N1454: R38.2 U7.7(NSLEEP)
$4N1580: R40.2 U7.5(IN2)
$4N1694: R41.2 U8.7(NSLEEP)
$4N1700: R42.2 U8.6(IN1)
$4N1706: R43.2 U8.5(IN2)
$5N509: R2.2 USB2.A5(CC1)
$5N510: R1.2 USB2.B5(CC2)

Not connected (* = marked no-connect by the designer): U1 2(PC13-TAMPER-RTC) 3(PC14-OSC32_IN) 4(PC15-OSC32_OUT) 14(PA4SPI1_NSSUSART2_CKADC12_IN4) 15(PA5SPI1_SCKADC12_IN5) 27(PB14SPI2_MISOUSART3_RTSTIM1_CH2N) 28(PB15SPI2_MOSITIM1_CH3N) 39(PB3JTDO) 40(PB4NJTRST) 41(PB5I2C1_SMBA) 45(PB8TIM4_CH3); USB2 A8(SBU1)* B8(SBU2)*

# Board 主控
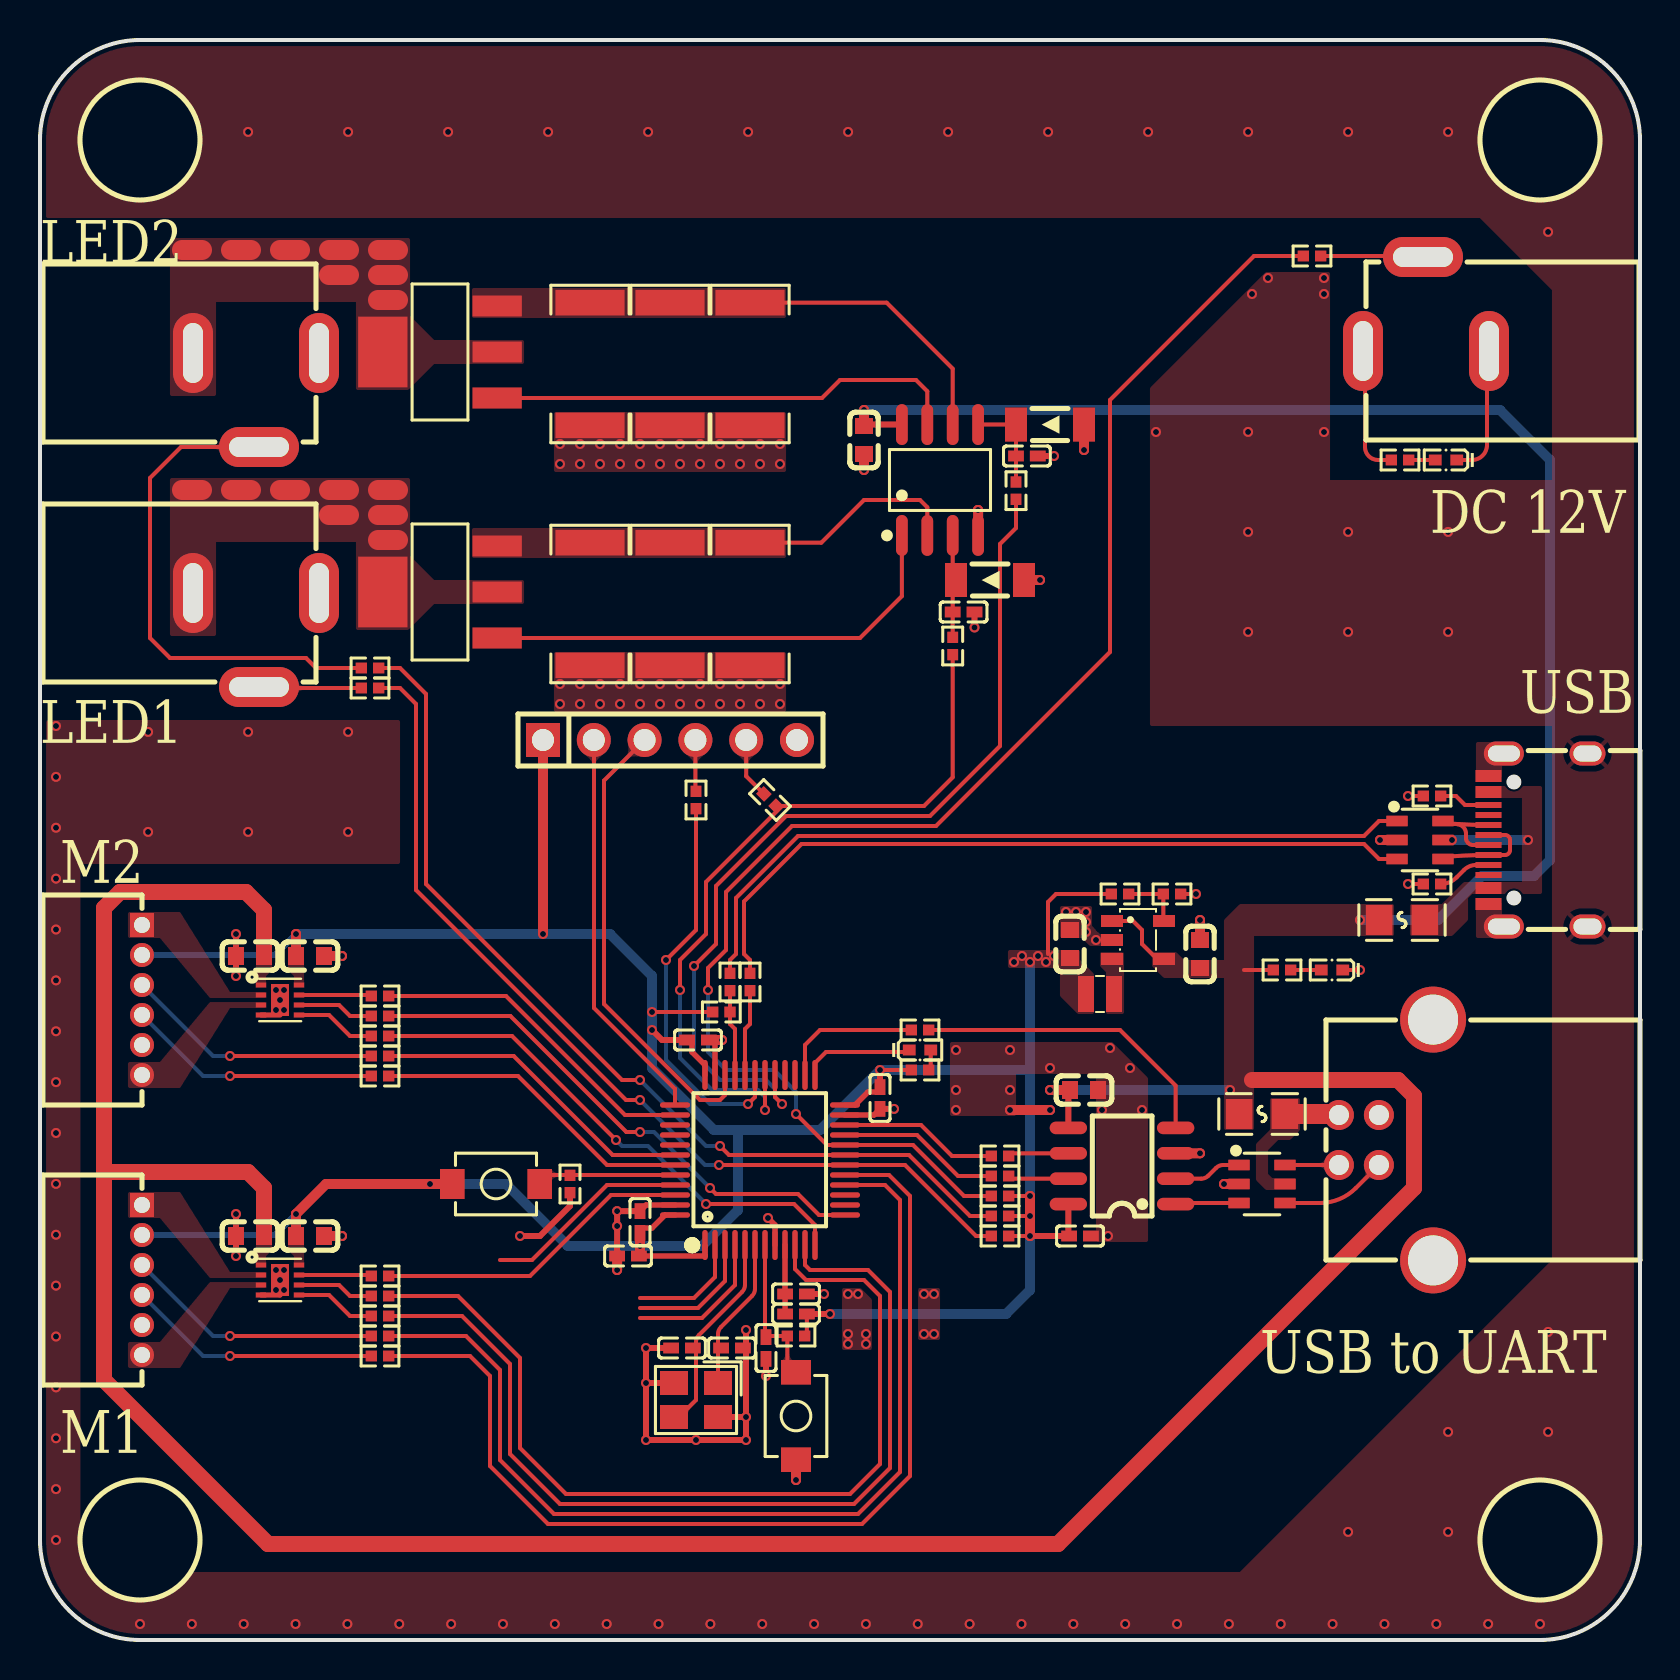
[diagram p5: board, top side]
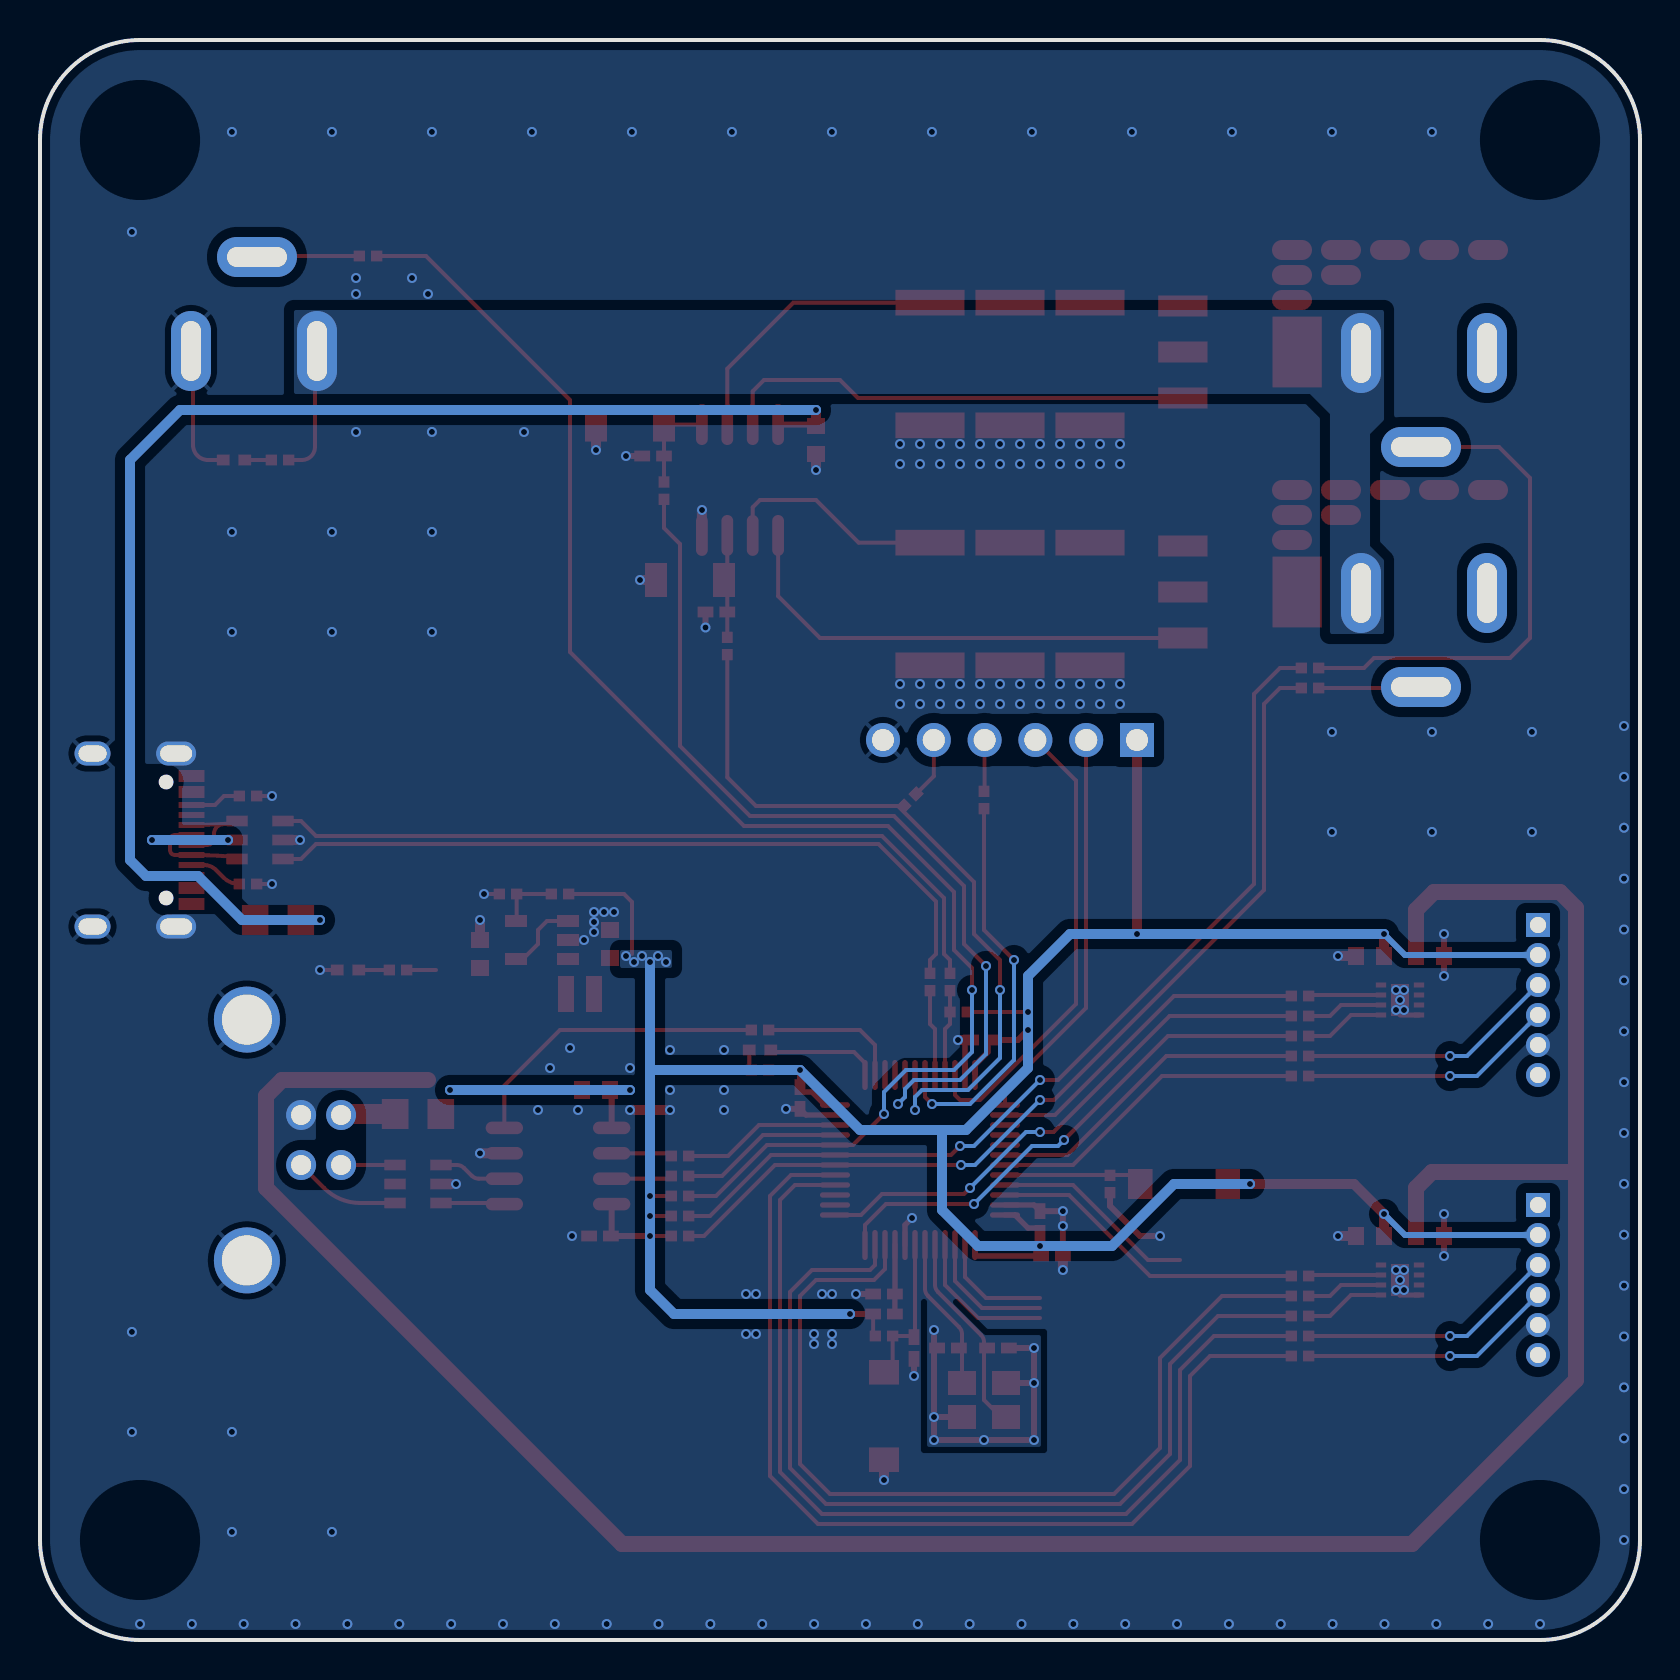
[diagram p6: board, bottom side, seen from below]

Outline 80 x 80 mm; copper layers: Top Layer, Bottom Layer. Coordinates in mm from the lower left corner of the outline.
Outline path: 0,75 0,5 arc(1.46,1.46) 5,0 75,0 arc(78.54,1.46) 80,5 80,75 arc(78.54,78.54) 75,80 5,80 arc(1.46,78.54) 0,75
Stack: Top Layer 0.035mm / Dielectric1 1.51mm FR4 er 4.5 / Bottom Layer 0.035mm

## Design rules (mm)
net USB_DP: usb
net USB_DN: usb
template: 自定义配置
spacing copperThickness1oz (default): track to track 0.2, other pairs 0.1 to 0.3
spacing copperThickness2oz: track to track 0.203, other pairs 0.152 to 0.3
track width copperThickness1oz (default): min 0.15, default 0.2, max 2
track width copperThickness2oz: min 0.203, default 0.254, max 2.54
differential pair differentialPair (default): width min 0.2, default 0.2, max 2.54; gap min 0.2, default 0.2
via viaSize (default): diameter min 0.5, default 0.5, max 10; hole min 0.3, default 0.3, max 6.3
net $4N1172 uses vbus
net $3N942 uses 直连
net $3N971 uses 直连
net 12V uses 直连
net VBUS uses 直连
pour e243 uses vbus
pour e291 uses vbus
pour e307 uses vbus
pour e313 uses vbus
pour e312 uses vbus
pour e326 uses vbus
pour e330 uses vbus
pour e335 uses vbus
pour e334 uses vbus
pour e824 uses 直连
pour e1490 uses 直连
pour e2146 uses copperRegion1
pour e5066 uses copperRegion

## Placement (name value [footprint] x y rotation side)
C3  10uF  [C0603]  58 34.3 270 top
C4  10uF  [C0603]  51.5 34.8 270 top
C5  10uF  [C0603]  52.2 27.5 180 top
C7  100nF  [C0402]  52 20.2 180 top
C8  1uF  [C0402]  46.18 51.4 180 top
C9  1uF  [C0402]  49.34 59.2 180 top
C10  10uF  [C0603]  41.2 60 90 top
C11  10uF  [C0603]  10.5 20.2 0 top
C12  10uF  [C0603]  13.5 20.2 180 top
C13  10uF  [C0603]  10.5 34.2 0 top
C14  10uF  [C0603]  13.5 34.2 180 top
C15  100nF  [C0402]  30 20.9 90 top
C16  100nF  [C0402]  32.9 30 0 top
C17  100nF  [C0402]  29.4 19.2 180 top
C18  100nF  [C0402]  42 27.1 270 top
C19  1uF  [C0402]  37.8 17.3 0 top
C20  100nF  [C0402]  36.3 14.6 270 top
C21  10pF  [C0402]  32.1 14.6 0 top
C22  10pF  [C0402]  34.6 14.6 0 top
CN1  ZH1.5-6AW  [CONN-TH_ZH1.5-6AW]  5.1 18 270 top
CN2  ZH1.5-6AW  [CONN-TH_ZH1.5-6AW]  5.1 32 270 top
D1  USBLC6-2SC6  [SOT-23-6_L2.9-W1.6-P0.95-LS2.8-BL]  69 40 270 top
D430  ZMM3V3  [LL-34_L3.5-W1.5-RD]  47.5 53 0 top
D431  ZMM3V3  [LL-34_L3.5-W1.5-RD]  50.5 60.77 0 top
D432  USBLC6-2SC6  [SOT-23-6_L2.9-W1.6-P0.95-LS2.8-BL]  61.1 22.8 270 top
H1  PZ254V-11-06P  [HDR-TH_6P-P2.54-V-M]  31.5 45 0 top
L1  2.2uH  [IND-SMD_L2.0-W1.6_WPN2016X]  53 32.3 180 top
L2  GZ1005D102CTF  [L0402]  37.8 16.3 0 top
NOREF  -  [Pad_e4122]  7.6 69.5 0 top
NOREF#2  -  [Pad_e4126]  12.5 69.5 0 top
NOREF#3  -  [Pad_e4133]  14.95 68.25 0 top
NOREF#4  -  [Pad_e4125]  10.05 69.5 0 top
NOREF#5  -  [Pad_e4137]  10.05 57.5 0 top
NOREF#6  -  [Pad_e4128]  17.4 69.5 0 top
NOREF#7  -  [Pad_e4141]  14.95 56.25 0 top
NOREF#8  -  [Pad_e4135]  17.4 67 0 top
NOREF#9  -  [Pad_e4140]  17.4 57.5 0 top
NOREF#10  -  [Pad_e4143]  17.4 55 0 top
NOREF#11  -  [Pad_e4138]  12.5 57.5 0 top
NOREF#12  -  [Pad_e4134]  17.4 68.25 0 top
NOREF#13  -  [Pad_e4136]  7.6 57.5 0 top
NOREF#14  -  [Pad_e4142]  17.4 56.25 0 top
NOREF#15  -  [Pad_e4139]  14.95 57.5 0 top
NOREF#16  -  [Pad_e4127]  14.95 69.5 0 top
Q1  NCE0106R  [SOT-223_L6.5-W3.5-P2.30-LS7.0-BR]  20 52.4 0 top
Q2  NCE0106R  [SOT-223_L6.5-W3.5-P2.30-LS7.0-BR]  20 64.4 0 top
R1  4.7kΩ  [R0402]  69.6 42.2 0 top
R2  4.7kΩ  [R0402]  69.6 37.8 0 top
R3  100kΩ  [R0402]  54 37.3 180 top
R4  22.1kΩ  [R0402]  56.6 37.3 180 top
R6  0Ω  [R0402]  48 23.2 0 top
R8  0Ω  [R0402]  48 24.2 0 top
R10  0Ω  [R0402]  44 30.5 0 top
R11  0Ω  [R0402]  63.6 69.2 0 top
R12  0Ω  [R0402]  16.5 47.6 180 top
R13  0Ω  [R0402]  16.5 48.6 180 top
R16  1.5kΩ  [R0402]  45.63 49.7 90 top
R17  1.5kΩ  [R0402]  48.8 57.47 90 top
R19  12Ω  [R2512]  27.5 51.8 90 top
R20  12Ω  [R2512]  31.5 51.8 90 top
R21  12Ω  [R2512]  35.5 51.8 90 top
R25  12Ω  [R2512]  27.5 63.8 90 top
R26  12Ω  [R2512]  31.5 63.8 90 top
R27  12Ω  [R2512]  35.5 63.8 90 top
R32  4.7kΩ  [R0402]  48 20.2 180 top
R33  4.7kΩ  [R0402]  48 21.2 180 top
R34  0Ω  [R0402]  17 15.2 180 top
R35  0Ω  [R0402]  17 14.2 180 top
R36  0Ω  [R0402]  17 29.2 180 top
R37  0Ω  [R0402]  17 28.2 180 top
R38  0Ω  [R0402]  17 18.2 180 top
R39  0Ω  [R0402]  17 17.2 180 top
R40  0Ω  [R0402]  17 16.2 180 top
R41  0Ω  [R0402]  17 32.2 180 top
R42  0Ω  [R0402]  17 31.2 180 top
R43  0Ω  [R0402]  17 30.2 180 top
R44  4.7kΩ  [R0402]  26.5 22.8 270 top
R45  0Ω  [R0402]  36.5 42 135 top
R46  0Ω  [R0402]  32.8 42 90 top
R47  4.7kΩ  [R0402]  37.8 15.2 0 top
R49  22Ω  [R0402]  35.5 32.9 90 top
R50  22Ω  [R0402]  34.5 32.9 90 top
R52  1.5kΩ  [R0402]  34.07 31.4 180 top
R53  4.7kΩ  [R0402]  48 22.2 0 top
R54  4.7kΩ  [R0402]  62.1 33.5 180 top
R56  22.1kΩ  [R0402]  68 59 180 top
R58  1.5kΩ  [R0402]  44 28.5 180 top
SW1  TS342A2P 160gf 021  [KEY-SMD_L3.9-W3.0-LS5.0]  22.8 22.8 180 top
SW2  TS342A2P 160gf 021  [KEY-SMD_L3.9-W3.0-LS5.0]  37.8 11.2 270 top
U1  STM32F103CBT6  [LQFP-48_L7.0-W7.0-P0.50-LS9.0-BL]  36 24 0 top
U3  DC-005-2.5  [DC-IN-TH_DC-005-2.5_C9900097950]  69.3 66.8 180 top
U4  DC-005-2.5  [DC-IN-TH_DC-005-2.5_C9900097950]  10.8 50 0 top
U5  DC-005-2.5  [DC-IN-TH_DC-005-2.5_C9900097950]  10.8 62 0 top
U7  DRV8837CDSGR  [WSON-8_L2.0-W2.0-P0.50-TL-EP]  12 18 0 top
U8  DRV8837CDSGR  [WSON-8_L2.0-W2.0-P0.50-TL-EP]  12 32 0 top
U10  CH340N  [SOP-8_L4.9-W3.9-P1.27-LS6.0-BL]  54.1 23.7 90 top
U11  LM358  [SOIC-8_L4.9-W3.9-P1.27-LS6.0-BL]  45 58 0 top
U13  M3406-ADJ  [SOT-23-5_L3.0-W1.7-P0.95-LS2.8-BR]  54.9 35 180 top
U14  XL-1005SURC  [LED0402-RD]  70.3 59 180 top
U15  XL-1005SURC  [LED0402-RD]  64.6 33.5 180 top
U16  SMD0805B050TF  [F0805]  61.1 26.3 0 top
U17  XL-1005SURC  [LED0402-RD]  44 29.5 0 top
U18  SMD0805B050TF  [F0805]  68.1 36 0 top
USB1  USB-U270-BWS  [USB-TH_U270-BWS]  67.3 25 270 top
USB2  USB-TYPE-C-018  [USB-C_SMD-TYPE-C-31-M-12]  74.9 40 90 top
X1  8MHz  [CRYSTAL-SMD_4P-L3.2-W2.5-BL]  32.8 12 180 top

## Footprints (pads in the part's own frame, mm; a bottom-side part is the same pattern mirrored in y, then rotated)
C0402
  rect 0.79x0.54 smd: 1(-0.545,0) 2(0.545,0)
C0603
  rect 0.8x0.9 smd: 1(-0.7,0) 2(0.7,0)
CONN-TH_ZH1.5-6AW
  rect 1.2x1.2 hole 0.8: 1(-3.751,0)
  round 1.2 hole 0.8: 2(-2.251,0) 3(-0.75,0) 4(0.749,0) 5(2.251,0) 6(3.751,0)
CRYSTAL-SMD_4P-L3.2-W2.5-BL
  rect 1.4x1.2 smd: 1(-1.1,-0.85) 2(1.1,-0.85) 3(1.1,0.85) 4(-1.1,0.85)
DC-IN-TH_DC-005-2.5_C9900097950
  oval 2x4 hole 1x3: 1(3.15,2.35) 2(-3.15,2.35)
  oval 4x2 hole 3x1: 3(0.15,-2.35)
F0805
  rect 1.335x1.5 smd: 1(-1.143,0) 2(1.143,0)
HDR-TH_6P-P2.54-V-M
  rect 1.7x1.7 hole 1.1: 1(-6.35,0)
  round 1.7 hole 1.1: 2(-3.81,0) 3(-1.27,0) 4(1.27,0) 5(3.81,0) 6(6.35,0)
IND-SMD_L2.0-W1.6_WPN2016X
  rect 0.8x1.8 smd: 1(-0.7,0) 2(0.7,0)
KEY-SMD_L3.9-W3.0-LS5.0
  rect 1.23x1.5 smd: 1(-2.185,0) 2(2.185,0)
L0402
  rect 0.79x0.54 smd: 1(-0.545,0) 2(0.545,0)
LED0402-RD
  rect 0.636x0.54 smd: 1(-0.538,0) 2(0.538,0)
LL-34_L3.5-W1.5-RD
  rect 1.1x1.7 smd: 1(-1.7,0) 2(1.7,0)
LQFP-48_L7.0-W7.0-P0.50-LS9.0-BL
  oval 0.27x1.5 smd: 1(-2.75,-4.25) 2(-2.25,-4.25) 3(-1.75,-4.25) 4(-1.25,-4.25) 5(-0.75,-4.25) 6(-0.25,-4.25) 7(0.25,-4.25) 8(0.75,-4.25) 9(1.25,-4.25) 10(1.75,-4.25) 11(2.25,-4.25) 12(2.75,-4.25) 25(2.75,4.25) 26(2.25,4.25) 27(1.75,4.25) 28(1.25,4.25) 29(0.75,4.25) 30(0.25,4.25) 31(-0.25,4.25) 32(-0.75,4.25) 33(-1.25,4.25) 34(-1.75,4.25) 35(-2.25,4.25) 36(-2.75,4.25)
  oval 1.5x0.27 smd: 13(4.25,-2.75) 14(4.25,-2.25) 15(4.25,-1.75) 16(4.25,-1.25) 17(4.25,-0.75) 18(4.25,-0.25) 19(4.25,0.25) 20(4.25,0.75) 21(4.25,1.25) 22(4.25,1.75) 23(4.25,2.25) 24(4.25,2.75) 37(-4.25,2.75) 38(-4.25,2.25) 39(-4.25,1.75) 40(-4.25,1.25) 41(-4.25,0.75) 42(-4.25,0.25) 43(-4.25,-0.25) 44(-4.25,-0.75) 45(-4.25,-1.25) 46(-4.25,-1.75) 47(-4.25,-2.25) 48(-4.25,-2.75)
Pad_e4122
  oval 2x1 smd: 1(0,0)
Pad_e4125
  oval 2x1 smd: 1(0,0)
Pad_e4126
  oval 2x1 smd: 1(0,0)
Pad_e4127
  oval 2x1 smd: 1(0,0)
Pad_e4128
  oval 2x1 smd: 1(0,0)
Pad_e4133
  oval 2x1 smd: 1(0,0)
Pad_e4134
  oval 2x1 smd: 1(0,0)
Pad_e4135
  oval 2x1 smd: 1(0,0)
Pad_e4136
  oval 2x1 smd: 1(0,0)
Pad_e4137
  oval 2x1 smd: 1(0,0)
Pad_e4138
  oval 2x1 smd: 1(0,0)
Pad_e4139
  oval 2x1 smd: 1(0,0)
Pad_e4140
  oval 2x1 smd: 1(0,0)
Pad_e4141
  oval 2x1 smd: 1(0,0)
Pad_e4142
  oval 2x1 smd: 1(0,0)
Pad_e4143
  oval 2x1 smd: 1(0,0)
R0402
  rect 0.566x0.54 smd: 1(-0.433,0) 2(0.433,0)
R2512
  rect 1.282x3.456 smd: 1(-3.067,0) 2(3.067,0)
SOIC-8_L4.9-W3.9-P1.27-LS6.0-BL
  oval 0.588x2.045 smd: 1(-1.905,-2.772) 2(-0.635,-2.772) 3(0.635,-2.772) 4(1.905,-2.772) 5(1.905,2.772) 6(0.635,2.772) 7(-0.635,2.772) 8(-1.905,2.772)
SOP-8_L4.9-W3.9-P1.27-LS6.0-BL
  oval 0.63x1.865 smd: 1(-1.905,-2.683) 2(-0.635,-2.683) 3(0.635,-2.683) 4(1.905,-2.683) 5(1.905,2.683) 6(0.635,2.683) 7(-0.635,2.683) 8(-1.905,2.683)
SOT-23-5_L3.0-W1.7-P0.95-LS2.8-BR
  rect 1.1x0.6 smd: 1(1.3,-0.95) 2(1.3,0) 3(1.3,0.95) 4(-1.3,0.95) 5(-1.3,-0.95)
SOT-23-6_L2.9-W1.6-P0.95-LS2.8-BL
  rect 0.532x1.072 smd: 1(-0.95,-1.149) 2(0,-1.149) 3(0.95,-1.149) 4(0.95,1.149) 5(0,1.149) 6(-0.95,1.149)
SOT-223_L6.5-W3.5-P2.30-LS7.0-BR
  rect 2.465x1.05 smd: 1(2.857,-2.3) 2(2.857,0) 3(2.857,2.3)
  rect 2.465x3.54 smd: 4(-2.857,0)
USB-C_SMD-TYPE-C-31-M-12
  oval 1.2x2 hole 0.8x1.6: 0(-4.325,1.706) 1(4.325,1.706)
  oval 1.2x1.8 hole 0.8x1.4: 2(4.325,-2.474) 3(-4.325,-2.474)
  rect 0.3x1.3 smd: A1(-3.35,2.474) A4(-2.55,2.474) A5(-1.25,2.474) A6(-0.25,2.474) A7(0.25,2.474) A8(1.25,2.474) A9(2.55,2.474) A12(3.35,2.474) B1(3.05,2.474) B4(2.25,2.474) B5(1.75,2.474) B6(0.75,2.474) B7(-0.75,2.474) B8(-1.75,2.474) B9(-2.25,2.474) B12(-3.05,2.474)
USB-TH_U270-BWS
  round 1.5 hole 1: 1(-1.25,-2.355) 2(1.25,-2.355) 3(1.25,-0.355) 4(-1.25,-0.355)
  round 3.3 hole 2.5: 5(-6.02,2.355) 6(6.02,2.355)
WSON-8_L2.0-W2.0-P0.50-TL-EP
  rect 0.521x0.25 smd: 1(-0.95,0.75) 2(-0.95,0.25) 3(-0.95,-0.25) 4(-0.95,-0.75) 5(0.95,-0.75) 6(0.95,-0.25) 7(0.95,0.25) 8(0.95,0.75)
  rect 0.9x1.6 smd: 9(0,0)

## Nets
As in the schematic, except:
$3N942: NOREF#5.1 NOREF#7.1 NOREF#9.1 NOREF#10.1 NOREF#11.1 NOREF#13.1 NOREF#14.1 NOREF#15.1 Q1.2 Q1.4 U4.2
$3N971: NOREF.1 NOREF#2.1 NOREF#3.1 NOREF#4.1 NOREF#6.1 NOREF#8.1 NOREF#12.1 NOREF#16.1 Q2.2 Q2.4 U5.2

Pads without a net: U1 2 3 4 14 15 39 40 41 45; USB2 A8 B8

## Via types
v1: diameter 0.5, hole 0.3, Top Layer to Bottom Layer, 251 vias

## Routing (per net, layer and track width the routed paths; a pad name or vN(x,y) marks a point on that pad's centre or on a via; arc(x,y) is an arc through that point)
3V3: length 165.6
  Top Layer w0.2: R58.2 v1(42,28.5) ; R52.2 v1(30.6,31.4) ; L2.2 38.34,15.31 R47.2 ; R33.1 49.49,21.2 ; R3.2 50.8,37.3 50.4,36.9 50.4,34.3 ; R53.2 v1(49.5,22.2) ; R32.1 v1(49.5,20.2)
  Top Layer w0.27: U1.24 40.75,26.75 41.4,27.4 42,27.4 C18.1 ; C17.1 33.25,19.2 U1.1 ; 30,20.35 30,20.6 30.6,20.6 31.25,21.25 U1.48 ; U1.36 33.25,28.75 32.6,29.4 32.6,30 C16.1
  Top Layer w0.3: v1(49.5,20.2) C7.2 51.42,20.24 51.42,21.79 ; C16.1 31.1,30 v1(30.6,30.5) ; C18.1 v1(42,28.5) ; L2.2 v1(39.5,16.3)
  Top Layer w0.5: 30,20.35 30,19.25 C17.1 ; H1.1 25.15,35.35 ; C12.2 v1(12.8,21.3) 14.3,22.8 v1(19.5,22.8) SW1.2 ; v1(12.8,35.3) C14.2 ; v1(49.5,20.2) v1(49.5,22.2)
  Bottom Layer w0.3: CN1.2 11.75,20.25 v1(12.8,21.3) ; v1(12.8,35.3) 11.75,34.25 CN2.2
  Bottom Layer w0.5: 34.9,25.3 34.9,21.5 33.1,19.7 v1(30,19.7) 26.4,19.7 23.3,22.8 v1(19.5,22.8) ; 49.5,28.5 v1(42,28.5) 39,25.5 33.7,25.5 30.6,28.6 v1(30.6,30.5) v1(30.6,31.4) 30.6,33.2 28.5,35.3 v1(25.15,35.3) v1(12.8,35.3) ; 49.5,28.5 v1(49.5,22.2) v1(49.5,21.2) v1(49.5,20.2) 49.5,17.5 48.3,16.3 v1(39.5,16.3) ; 49.5,28.5 v1(49.5,33.9)
  vias: v1(48.7,33.9) v1(49.1,34.2) v1(49.9,34.2) v1(50.3,33.9) v1(50.7,34.2)
3V3_A: length 3.5
  Top Layer w0.27: U1.9 37.25,17.31 C19.1 L2.1
12V: length 6.4
  Top Layer w0.2: 66.25,64.4 66.25,59.65 arc(66.44,59.19) 66.9,59 R56.2
12V_D: length 75.6
  Top Layer w0.2: v1(33.4,32.5) 33.4,33.6 34.3,34.5 34.3,37.4 37.6,40.7 44.8,40.7 53.5,49.4 53.5,62 60.7,69.2 R11.1 ; R53.1 46.2,22.2 43.65,24.75 U1.20 39.35,24.75 v1(37.8,26.3)
  Bottom Layer w0.2: v1(37.8,26.3) 37.8,27.4 36.7,28.5 34.3,28.5 33.4,29.4 v1(33.4,32.5)
GND: length 68.2
  Top Layer w0.2: R1.1 v1(68.4,42.2) ; 72.35,64.4 72.35,59.75 arc(72.13,59.22) 71.6,59 U14.1 ; R4.1 v1(57.8,37.3) ; R2.1 v1(68.4,37.8) ; U15.1 v1(66,33.5)
  Top Layer w0.25: U7.4 12,17.25 v1(12,18) ; U8.4 12,31.25
  Top Layer w0.27: U1.47 30.31,21.75 C15.2 ; U1.35 33.75,30 ; U1.23 41.69,26.25 42,26.56 ; v1(36.4,21.1) 36.75,20.75 U1.8
  Top Layer w0.3: v1(9.8,35.3) C13.1 v1(9.8,33.2) ; C20.2 v1(36.3,13.2) ; C9.1 v1(50.7,59.2) ; v1(24,20.2) 25,20.2 26.5,21.7 26.5,22.37 ; C15.2 v1(28.85,21.44) C17.2 ; 35.3,14.6 v1(35.3,15.5) ; 35.3,14.6 C22.2 ; 35.3,14.6 v1(35.3,11.15) ; v1(35.3,11.15) v1(35.3,10) v1(30.3,10) v1(30.3,12.85) ; v1(35.3,11.15) X1.4 ; v1(9.8,21.3) C11.1 v1(9.8,19.2) ; v1(30.3,12.85) X1.2 ; v1(30.3,12.85) v1(30.3,14.6) C21.1 ; C8.1 v1(46.72,50.62) ; 42,26.56 v1(42.7,26.56) ; C19.2 v1(39.2,17.3)
  Top Layer w0.5: v1(50.5,26.5) v1(48.5,26.5) ; D430.2 v1(50,53) ; U10.3 v1(58,24.33) ; C16.2 v1(34.1,30) ; C10.1 v1(41.2,58.5) ; C17.2 v1(28.85,18.5) ; C14.1 v1(15.1,34.2) ; D1.2 v1(67,40) ; C3.1 v1(58,36) ; D432.2 v1(59.2,22.8) ; v1(46.9,56.5) 46.91,56.5 U11.4 ; C12.1 v1(15.1,20.2) ; SW2.2 v1(37.8,8) ; D431.2 v1(52.2,59.5)
  vias: v1(0.8,45.7) v1(0.8,43.16) v1(0.8,40.61) v1(0.8,38.07) v1(0.8,35.53) v1(0.8,32.98) v1(0.8,30.44) v1(0.8,27.89) v1(0.8,25.35) v1(0.8,22.81) v1(0.8,20.26) v1(0.8,17.72) v1(0.8,15.18) v1(0.8,12.63) v1(0.8,10.09) v1(0.8,7.54) v1(0.8,5) v1(5,0.8) v1(5.4,45.4) v1(5.4,40.4) v1(7.59,0.8) v1(10.19,0.8) v1(10.4,75.4) v1(10.4,45.4) v1(10.4,40.4) v1(11.8,32.5) v1(11.8,31.5) v1(11.8,18.5) v1(11.8,17.5) v1(12,32) v1(12.2,32.5) v1(12.2,31.5) v1(12.2,18.5) v1(12.2,17.5) v1(12.78,0.8) v1(15.4,75.4) v1(15.4,45.4) v1(15.4,40.4) v1(15.37,0.8) v1(17.96,0.8) v1(20.4,75.4) v1(20.56,0.8) v1(23.15,0.8) v1(25.4,75.4) v1(25.74,0.8) v1(26,59.8) v1(26,58.8) v1(26,47.8) v1(26,46.8) v1(27,59.8) v1(27,58.8) v1(27,47.8) v1(27,46.8) v1(28,59.8) v1(28,58.8) v1(28,47.8) v1(28,46.8) v1(28.33,0.8) v1(28.85,20.7) v1(29,59.8) v1(29,58.8) v1(29,47.8) v1(29,46.8) v1(30,59.8) v1(30,58.8) v1(30,47.8) v1(30,46.8) v1(30.4,75.4) v1(30.93,0.8) v1(31,59.8) v1(31,58.8) v1(31,47.8) v1(31,46.8) v1(32,59.8) v1(32,58.8) v1(32,47.8) v1(32,46.8) v1(32.8,10) v1(33,59.8) v1(33,58.8) v1(33,47.8) v1(33,46.8) v1(33.52,0.8) v1(34,59.8) v1(34,58.8) v1(34,47.8) v1(34,46.8) v1(35,59.8) v1(35,58.8) v1(35,47.8) v1(35,46.8) v1(35.4,75.4) v1(36,59.8) v1(36,58.8) v1(36,47.8) v1(36,46.8) v1(36.11,0.8) v1(37,59.8) v1(37,58.8) v1(37,47.8) v1(37,46.8) v1(38.7,0.8) v1(40.4,75.4) v1(40.4,17.3) v1(40.4,15.3) v1(40.4,14.8) v1(40.9,17.3) v1(41.3,15.3) v1(41.3,14.8) v1(41.3,0.8) v1(43.89,0.8) v1(44.2,17.3) v1(44.2,15.3) v1(44.7,17.3) v1(44.7,15.3) v1(45.4,75.4) v1(45.8,29.5) v1(45.8,27.5) v1(45.8,26.5) v1(46.48,0.8) v1(48.5,29.5) v1(48.5,27.5) v1(49.07,0.8) v1(50.4,75.4) v1(50.5,28.6) v1(51.3,36.4) v1(51.67,0.8) v1(51.8,36.4) v1(52.3,36.4) v1(52.3,35.9) v1(52.3,35.4) v1(52.8,35) v1(53.1,26.5) v1(53.4,20.2) v1(53.5,29.6) v1(54.26,0.8) v1(54.5,28.6) v1(55.1,26.5) v1(55.4,75.4) v1(55.8,60.4) v1(56.85,0.8) v1(59.44,0.8) v1(60.4,75.4) v1(60.4,60.4) v1(60.4,55.4) v1(60.4,50.4) v1(60.6,67.3) v1(61.4,68.1) v1(62.04,0.8) v1(64.2,68.1) v1(64.2,67.3) v1(64.2,60.4) v1(64.63,0.8) v1(65.4,75.4) v1(65.4,55.4) v1(65.4,50.4) v1(65.4,5.4) v1(67.22,0.8) v1(69.81,0.8) v1(70.4,75.4) v1(70.4,55.4) v1(70.4,50.4) v1(70.4,10.4) v1(70.4,5.4) v1(72.41,0.8) v1(75,0.8) v1(75.4,70.4) v1(75.4,15.4) v1(75.4,10.4)
VBUS: length 3.8
  Bottom Layer w0.5: v1(70.6,40) v1(74.4,40)
(no net): length 30.1
  Top Layer w0.2: 30,17.1 32.7,17.1 33.75,18.15 U1.2 ; U1.45 28.35,22.75 24.6,19 23,19 ; 30,16.6 32.9,16.6 34.25,17.95 U1.3 ; U1.4 34.75,17.75 33.1,16.1 30,16.1
D+: length 3.2
  Top Layer w0.2: D432.3 56.84,21.85 56.78,21.79
D-: length 3.4
  Top Layer w0.2: U10.2 58.06,23.06 arc(58.25,23.1) 58.41,23.21 58.8,23.6 arc(58.97,23.71) 59.16,23.75 D432.1
DN: length 5.5
  Top Layer w0.2: USB2.A7 73.25,40.25 arc(73.43,40.18) 73.5,40 73.5,39.5 arc(73.43,39.32) 73.25,39.25 USB2.B7 arc(71.13,39.22) 69.84,39.12
DP: length 4.9
  Top Layer w0.2: 70.78,40.8 70.89,40.79 arc(71.18,40.63) 71.3,40.32 71.3,40.1 arc(71.4,39.85) 71.65,39.75 USB2.A6 ; 70.78,40.8 arc(71.6,40.76) USB2.B6 ; 70.78,40.8 arc(70.74,40.81) 70.7,40.81 arc(70.27,40.84) 69.84,40.88
LED1_D: length 47.4
  Top Layer w0.2: v1(30,27) 29.3,27 18.8,37.5 18.8,46.8 18,47.6 R12.1 ; R32.2 46.8,20.2 43.25,23.75 U1.18 v1(33.95,23.75)
  Bottom Layer w0.2: v1(33.95,23.75) 33.25,23.75 v1(30,27)
LED1_DIM: length 37.4
  Top Layer w0.2: v1(32,32.5) 32,34 33.3,35.3 33.3,37.9 37.1,41.7 44.2,41.7 45.63,43.14 R16.1 ; U1.30 v1(36.25,26.5)
  Bottom Layer w0.2: v1(36.25,26.5) 36.25,27.15 35.9,27.5 33.6,27.5 32,29.1 v1(32,32.5)
LED2_D: length 47.5
  Top Layer w0.2: R33.2 46.5,21.2 43.45,24.25 U1.19 34.45,24.25 v1(34,24.7) ; v1(30,28) 29.1,28 19.3,37.8 19.3,47.3 18,48.6 R13.1
  Bottom Layer w0.2: v1(30,28) 33.3,24.7 v1(34,24.7)
LED2_DIM: length 45.9
  Top Layer w0.2: v1(37.1,26.8) 36.75,27.15 U1.29 ; v1(32.7,33.7) 33.8,34.8 33.8,37.7 37.3,41.2 44.5,41.2 48,44.7 48,54.8 48.8,55.6 R17.1
  Bottom Layer w0.2: v1(32.7,33.7) 32.7,29.3 34,28 36.3,28 36.75,27.55 36.75,27.15 v1(37.1,26.8)
M1_A: length 49.4
  Top Layer w0.2: R34.1 21.3,15.2 23,13.5 23,9 25.7,6.3 40.9,6.3 43,8.4 43,22 42.25,22.75 U1.16
M1_B: length 50.9
  Top Layer w0.2: R35.1 21.5,14.2 22.5,13.2 22.5,8.7 25.4,5.8 41.1,5.8 43.5,8.2 43.5,22.2 42.45,23.25 U1.17
M1_EN: length 16
  Top Layer w0.2: U1.46 28.55,22.25 24.5,18.2 R38.1
M1_IN1: length 46.3
  Top Layer w0.2: U1.10 37.75,18.55 38.3,18 41.2,18 42,17.2 42,8.8 40.5,7.3 26.3,7.3 24,9.6 24,14.1 20.9,17.2 R39.1
M1_IN2: length 47
  Top Layer w0.2: U1.11 38.25,18.75 38.5,18.5 41.4,18.5 42.5,17.4 42.5,8.6 40.7,6.8 26,6.8 23.5,9.3 23.5,13.8 21.1,16.2 R40.1
M2_A: length 16.4
  Top Layer w0.2: R36.1 23.68,29.2 28.63,24.25 U1.42
M2_B: length 16.2
  Top Layer w0.2: U1.43 28.35,23.75 23.9,28.2 R37.1
M2_EN: length 16.8
  Top Layer w0.2: U1.38 29.25,26.25 23.3,32.2 R41.1
M2_IN1: length 26.9
  Top Layer w0.2: R42.1 23.52,31.2 29.32,25.4 v1(30,25.4) ; v1(33.5,22.6) 33.8,22.3 37.9,22.3 38.95,21.25 U1.13
  Bottom Layer w0.2: v1(33.5,22.6) 30.7,25.4 v1(30,25.4)
M2_IN2: length 26.2
  Top Layer w0.2: v1(33.3,21.8) 37.7,21.8 38.75,20.75 U1.12 ; v1(28.8,25) 23.6,30.2 R43.1
  Bottom Layer w0.2: v1(33.3,21.8) 30.4,24.7 29.1,24.7 v1(28.8,25)
OSC_IN: length 10.2
  Top Layer w0.2: X1.3 31.95,11.15 32.8,12 32.8,14.89 arc(32.84,15.08) 32.95,15.25 35.1,17.4 arc(35.21,17.57) 35.25,17.76 U1.5
OSC_OUT: length 7.6
  Top Layer w0.2: X1.1 33.9,15.29 arc(33.94,15.48) 34.05,15.65 35.6,17.2 arc(35.71,17.37) 35.75,17.56 U1.6
RTS: length 7.1
  Top Layer w0.2: U1.26 38.25,29.75 39,30.5 R10.1
STATUS: length 5.6
  Top Layer w0.2: U17.1 43.36,29.4 39.3,29.4 38.75,28.85 U1.25
SWDCK: length 19.9
  Top Layer w0.2: H1.2 27.7,44.99 27.7,31.6 31.75,27.55 U1.37
SWDIO: length 23.2
  Top Layer w0.2: U1.34 34.25,27.25 34,27 33,27 28.2,31.8 28.2,42.97 H1.3
U_RX: length 8.2
  Top Layer w0.2: U1.21 43.85,25.25 45.9,23.2 R6.1
U_TX: length 8
  Top Layer w0.2: U1.22 44.05,25.75 45.6,24.2 R8.1
UART1_RXD: length 2.6
  Top Layer w0.2: R46.2 32.77,42.46 H1.4
UART1_TXD: length 3.1
  Top Layer w0.2: R45.2 35.31,43.19 H1.5
USB_DN: length 37.9
  Top Layer w0.2: 35.5,33.33 35.5,34 35.2,34.3 35.2,36.92 38.08,39.8 66.2,39.8 66.95,39.05 D1.3
USB_DP: length 38.5
  Top Layer w0.2: 34.5,33.33 34.5,34 34.8,34.3 34.8,37.1 37.9,40.2 66.2,40.2 66.95,40.95 D1.1
VUSB: length 220.6
  Top Layer w0.2: U13.1 54.65,35.95 55.1,35.5 55.1,34.8 55.85,34.05 U13.4 ; R54.2 60.2,33.5
  Top Layer w0.3: U10.5 51.42,27.42 C5.2 ; C10.2 41.27,60.77 U11.8
  Top Layer w0.5: C5.2 v1(50.5,27.5) ; v1(41.2,61.5) C10.2
  Top Layer w0.8: 60.6,28 67.9,28 68.7,27.2 68.7,22.6 50.9,4.8 11.4,4.8 3.2,13 3.2,23.4 ; 3.2,23.4 10.4,23.4 11.2,22.6 C11.2 ; 3.2,23.4 3.2,36.6 4,37.4 10.3,37.4 11.2,36.5 C13.2
  Bottom Layer w0.5: v1(41.2,61.5) 73,61.5 75.5,59 75.5,39 74.7,38.2 72.1,38.2 69.9,36 v1(66,36) ; v1(50.5,27.5) v1(59.5,27.5)
$1N1587: length 7
  Top Layer w0.2: SW1.1 25.44,23.25 U1.44
$1N1759: length 19.8
  Top Layer w0.2: v1(35.4,26.8) 35.75,27.15 U1.31 ; R46.1 32.8,35.5 v1(31.3,34)
  Bottom Layer w0.2: v1(31.3,34) 31.3,29 33.5,26.8 v1(35.4,26.8)
$1N1998: length 7.7
  Top Layer w0.2: SW2.1 37.37,13.82 R47.1 36.35,15.2 C20.1 36.25,15.19 U1.7
$1N2957: length 1
  Top Layer w0.2: U17.2 44.54,28.61 R58.1
$1N4338: length 4.3
  Top Layer w0.2: U1.33 34.75,30.55 34.5,30.8 R52.1 R50.1
$1N4342: length 4.3
  Top Layer w0.2: U1.32 35.25,30.55 35.5,30.8 R49.1
$2N1031: length 3.1
  Top Layer w0.2: R3.1 R4.2 56.17,35.98 U13.5
$2N1800: length 2.9
  Top Layer w0.2: U10.7 48.53,23.06
$2N1804: length 2.9
  Top Layer w0.2: U10.6 48.53,24.33
$2N1809: length 15.6
  Top Layer w0.2: U10.4 56.78,27.72 54,30.5 R10.2
$2N1973: length 5.1
  Top Layer w0.2: 69.15,69.2 R11.2
$2N2732: length 1.3
  Top Layer w0.2: R56.1 U14.2
$2N2770: length 1.5
  Top Layer w0.2: R54.1 U15.2
$2N2922: length 2.7
  Top Layer w1: 64.94,26.25 64.9,26.3 U16.2
$2N4697: length 5.4
  Top Layer w0.2: 66.94,23.75 65.79,22.59 arc(64.96,22.04) 63.99,21.85 D432.4
$2N4704: length 2.7
  Top Layer w0.2: 64.94,23.75 62.25,23.75
$3N875: length 5.1
  Top Layer w0.2: 10.95,47.6 R12.2
$3N910: length 25.3
  Top Layer w0.2: R13.2 13.8,48.6 13.3,49.1 6.5,49.1 5.5,50.1 5.5,58.1 7.05,59.65 U5.3
$3N1074: length 14.3
  Top Layer w0.2: U11.6 45.63,63.56 42.33,66.87 R27.2
$3N1402: length 24.1
  Top Layer w0.2: U11.1 43.09,52.19 41,50.1 Q1.1
$3N1420: length 23.8
  Top Layer w0.2: Q2.1 39.1,62.1 40,63 43.8,63 44.37,62.44 U11.7
$3N1439: length 5.1
  Top Layer w0.2: U11.3 C8.2 45.63,50.13
$3N1444: length 4.8
  Top Layer w0.2: R17.2 C9.2 D431.1 U11.5
$3N3109: length 11.3
  Top Layer w0.2: R21.2 39.07,54.87 41.2,57 44,57 44.37,56.64 U11.2
$4N1106: length 12.9
  Top Layer w0.2: R36.2 v1(9.5,29.2)
  Bottom Layer w0.2: v1(9.5,29.2) 8.65,29.2 CN2.3
$4N1110: length 12.7
  Top Layer w0.2: v1(9.5,28.2) R37.2
  Bottom Layer w0.2: v1(9.5,28.2) 8.15,28.2 CN2.4
$4N1176: length 12.9
  Top Layer w0.2: R34.2 v1(9.5,15.2)
  Bottom Layer w0.2: CN1.3 8.65,15.2 v1(9.5,15.2)
$4N1179: length 12.7
  Top Layer w0.2: v1(9.5,14.2) R35.2
  Bottom Layer w0.2: CN1.4 8.15,14.2 v1(9.5,14.2)
$4N1448: length 3.8
  Top Layer w0.2: R39.2 15.5,17.2 14.95,17.75 U7.6
$4N1454: length 3.6
  Top Layer w0.2: U7.7 16.52,18.25
$4N1580: length 4.1
  Top Layer w0.2: R40.2 15.5,16.2 14.45,17.25 U7.5
$4N1694: length 3.6
  Top Layer w0.2: U8.7 16.52,32.25 R41.2
$4N1700: length 3.8
  Top Layer w0.2: U8.6 14.95,31.75 15.5,31.2 R42.2
$4N1706: length 4.1
  Top Layer w0.2: R43.2 15.5,30.2 14.45,31.25 U8.5
$5N509: length 2.7
  Top Layer w0.2: USB2.A5 71.8,38.75 arc(71.48,38.69) 71.2,38.5 70.83,38.13 arc(70.46,37.89) R2.2
$5N510: length 2.6
  Top Layer w0.2: R1.2 70.8,42.2 71.25,41.75 USB2.B5

## Copper pours and planes (outline as drawn; the poured copper is in the pictures)
3V3 on Top Layer: 12.7,32.7 12.7,33.2 12.4,33.5 12.4,34.2 13.2,34.2 13.2,32.7
3V3 on Top Layer: 52,34.5 52,34 52.7,33.3 52.7,31.3 51.9,31.3 51,32.2 51,33.6 48.4,33.6 48.4,34.5
3V3 on Top Layer: 12.7,18.7 12.7,19.2 12.4,19.5 12.4,20.2 13.2,20.2 13.2,18.7
3V3 on Bottom Layer: 48.4,34.5 51,34.5 51,33.6 48.4,33.6
12V on Bottom Layer: 67.3,66.5 12.8,66.5 12.8,61 13.5,60.3 13.5,54.7 12.8,54 12.8,50.3 15.5,50.3 15.5,61.3 16.5,62.3 67.3,62.3
GND on Top Layer: 52.6,36.7 52.6,35.7 53,35.3 53.6,35.3 53.6,34.7 52.5,34.7 52.1,35.1 51,35.1 51,36.7
GND on Top Layer: 25.7,61.4 37.3,61.4 37.3,58.4 25.7,58.4
GND on Top Layer: 40.1,17.6 41.1,17.6 41.6,17.1 41.6,14.5 40.1,14.5
GND on Top Layer: 25.7,49.4 37.3,49.4 37.3,46.4 25.7,46.4
GND on Top Layer: 43.9,17.6 45,17.6 45,15 43.9,15
GND on Top Layer: 71.8,37.1 73.1,37.1 73.1,35.1 71.8,35.1
GND on Top Layer: 64.5,58 75.6,58 75.6,67.5 72,71.1 0,71.1 0,80 80,80 80,0 0,0 0,46 18,46 18,38.8 2.03,38.8 2.03,5.1 3.3,5.1 3.3,3.4 60,3.4 75.6,19 75.6,45.7 55.5,45.7 55.5,62.6 61.3,68.4 64.5,68.4
GND on Top Layer: 71.8,44.9 73.1,44.9 73.1,42.9 71.8,42.9
GND on Top Layer: 45.5,29.9 53.6,29.9 55.4,28.1 55.4,19.9 52.8,19.9 52.8,28.3 48.8,28.3 48.8,26.2 45.5,26.2
GND on Bottom Layer: 0,80 80,80 80,0 0,0
VBUS on Top Layer: 71.6,37.3 71.4,37.1 71.4,36 70.6,35.2 68.5,35.2 68.5,36.8 70.1,36.8 71.2,37.9 74.1,37.9 74.1,42.1 72.43,42.1 72.43,42.7 75.1,42.7 75.1,37.3
VUSB on Top Layer: 11.3,32.7 11.3,33.2 11.6,33.5 11.6,34.2 10.8,34.2 10.8,32.7
VUSB on Top Layer: 55.6,34.4 56.8,34.4 57.2,34 59.2,34 59.2,36 60,36.8 67.7,36.8 67.7,35.2 60.7,35.2 60.7,25.5 59.2,25.5 59.2,33.1 56.2,33.1 55.6,33.7
VUSB on Top Layer: 11.3,18.7 11.3,19.2 11.6,19.5 11.6,20.2 10.8,20.2 10.8,18.7
$2N1030 on Top Layer: 54.2,31.3 54.2,34.4 53,34.4 53,33.7 53.3,33.4 53.3,31.3
$2N2922 on Top Layer: 62.8,22.5 61.3,22.5 60.8,23 60.8,24.8 61.5,25.5 61.5,27.1 63,27.1 63,25.5 62.5,25 61.9,25 61.4,24.5 61.4,23.3 61.6,23.1 62.8,23.1
$3N942 on Top Layer: 8.8,50.2 8.8,54.9 15.8,54.9 15.8,50.5 18.4,50.5 19.7,51.8 24.2,51.8 24.2,53 19.7,53 18.5,54.2 18.5,58.1 6.5,58.1 6.5,50.2
$3N971 on Top Layer: 8.8,62.2 8.8,66.9 15.8,66.9 15.8,62.5 18.4,62.5 19.7,63.8 24.2,63.8 24.2,65 19.7,65 18.5,66.2 18.5,70.1 6.5,70.1 6.5,62.2
$3N1074 on Top Layer: 21.6,67.6 37.3,67.6 37.3,66.1 21.6,66.1
$3N3109 on Top Layer: 21.6,55.6 37.3,55.6 37.3,54.1 21.6,54.1
$4N1059 on Top Layer: 4.4,27.6 7,27.6 9.5,31.6 11.3,31.6 11.3,31.9 8.5,31.9 6,28.9 4.4,28.9
$4N1129 on Top Layer: 4.4,36.4 7,36.4 9.5,32.4 11.3,32.4 11.3,32.1 8.5,32.1 6,35.1 4.4,35.1
$4N1168 on Top Layer: 4.4,13.6 7,13.6 9.5,17.6 11.3,17.6 11.3,17.9 8.5,17.9 6,14.9 4.4,14.9
$4N1172 on Top Layer: 4.4,22.4 7,22.4 9.5,18.4 11.3,18.4 11.3,18.1 8.5,18.1 6,21.1 4.4,21.1

Small or netless copper shapes (teardrops, artwork), in the pictures only: 12 on Top Layer, 6 on Bottom Layer

## Text on the board
Top Solder Mask Layer: 工件载台控制板 v1.0A | by YP.Wang
Top Silkscreen Layer: LED2 | LED1 | M2 | M1 | USB to UART | DC 12V | USB
